# Altium project rfsoc-fr1-beamformer.PrjPcb (part 1 of 2)
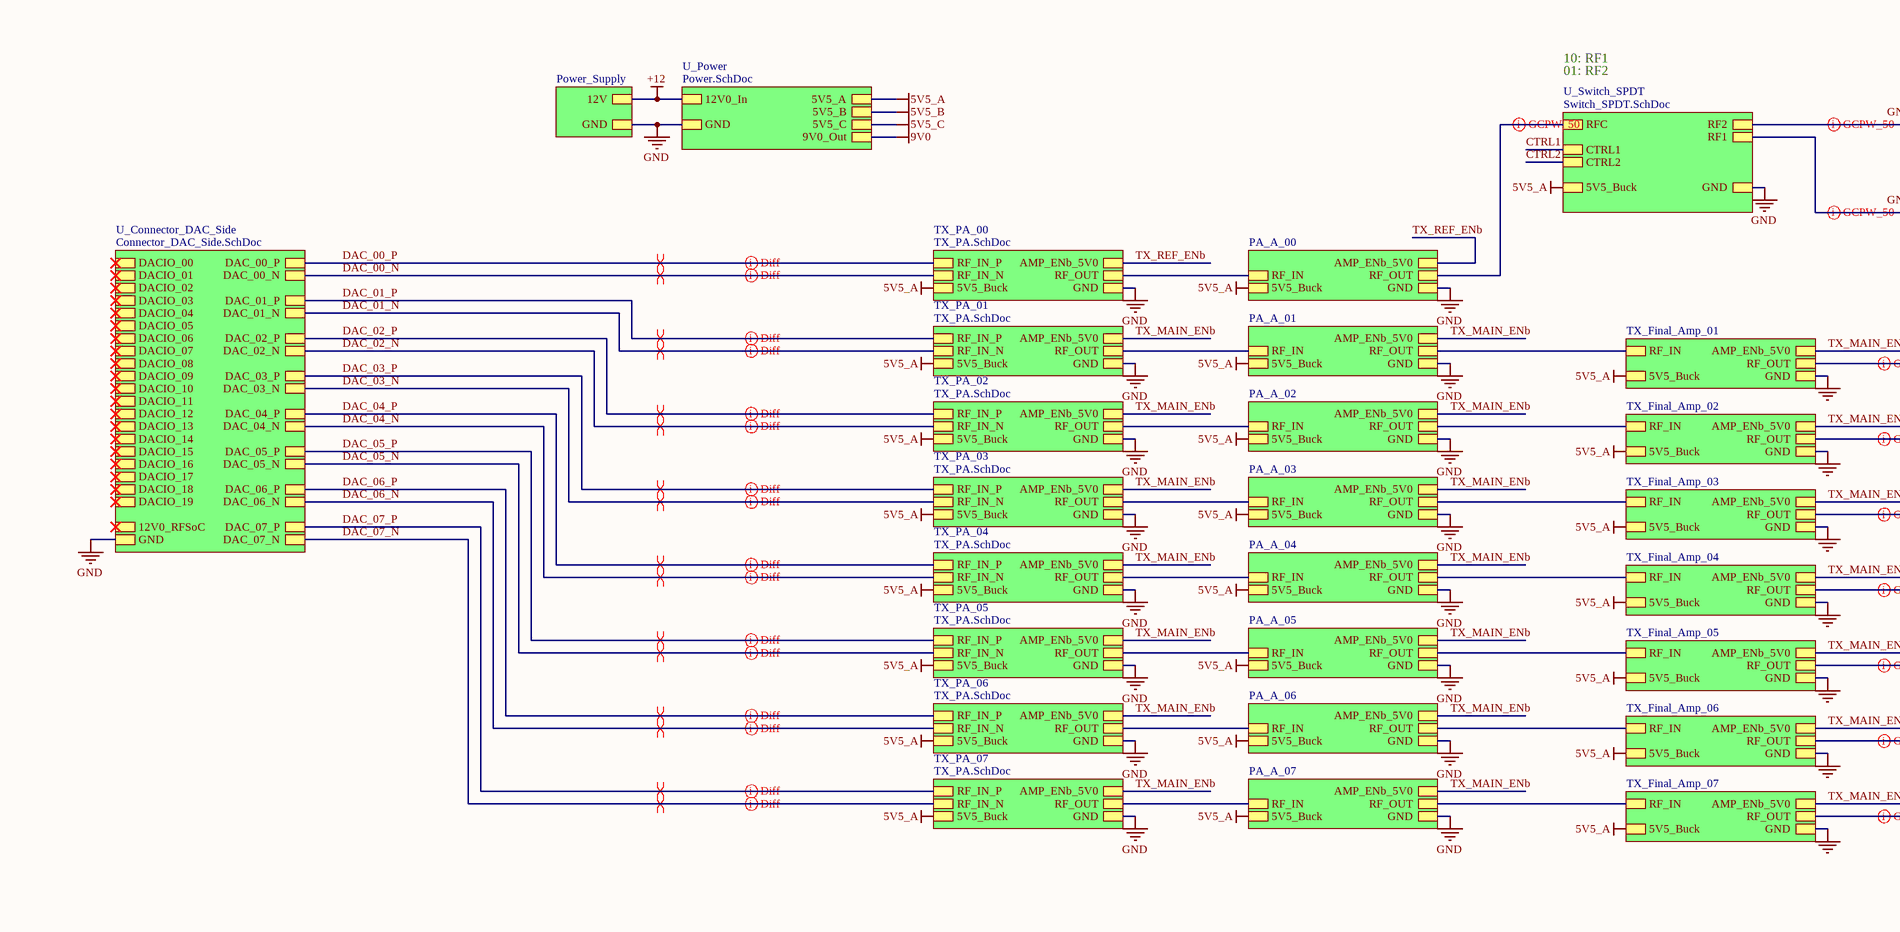
[diagram p0: Main.SchDoc, top left]
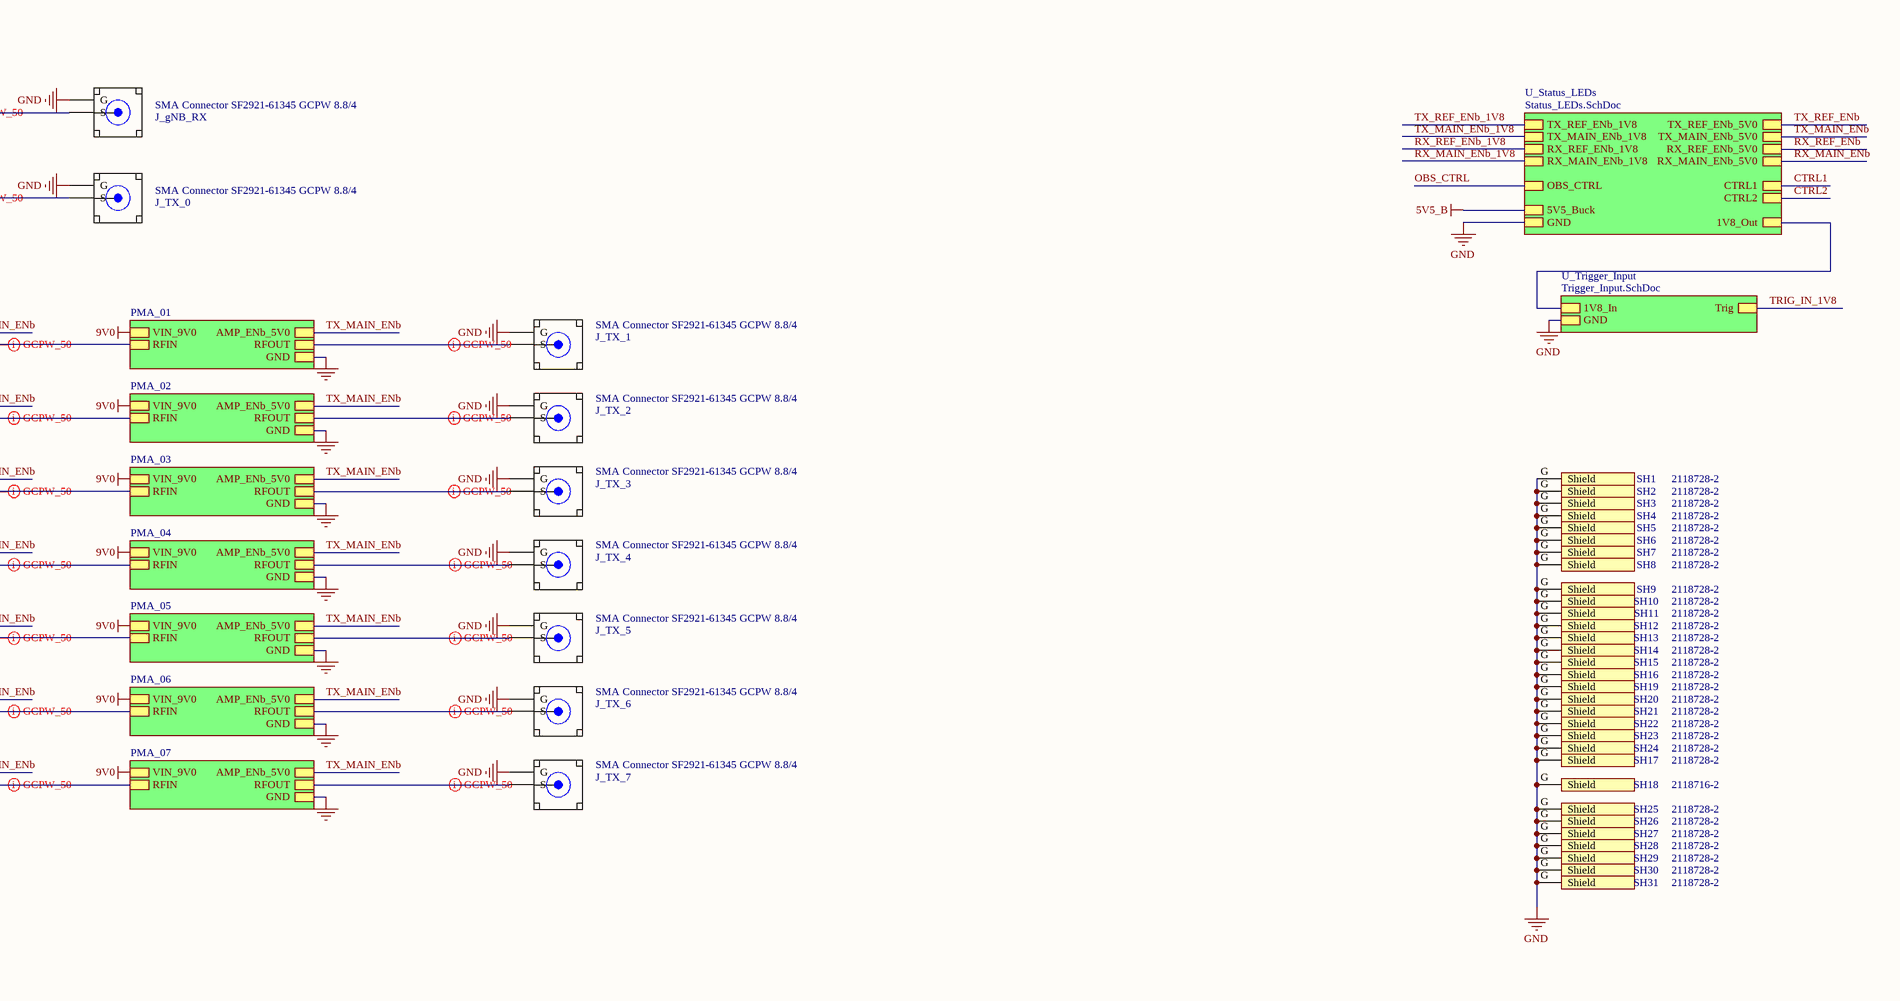
[diagram p1: Main.SchDoc, top right]
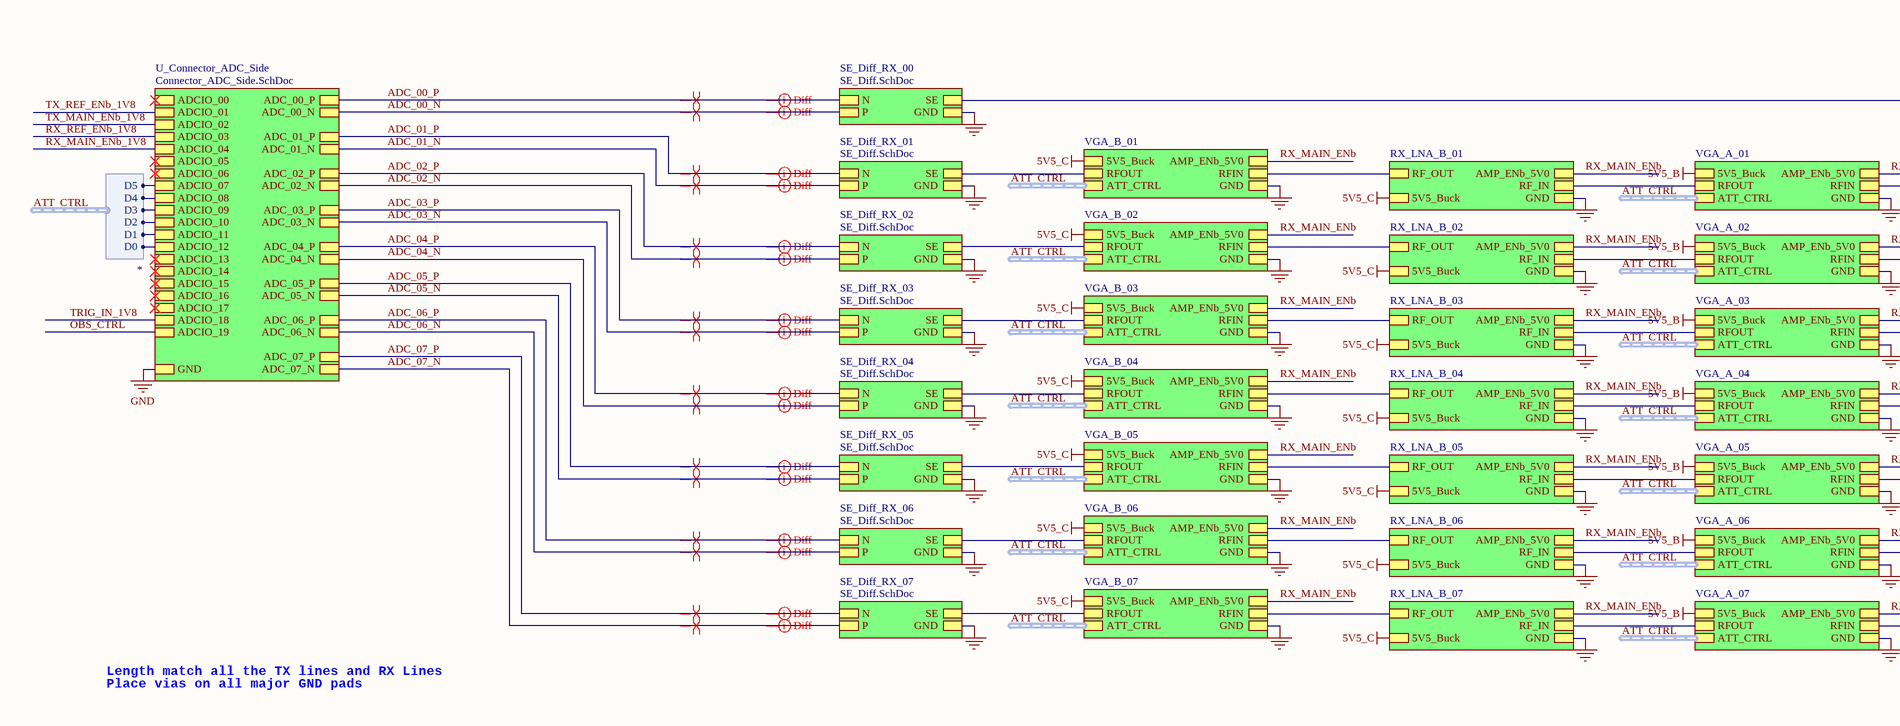
[diagram p2: Main.SchDoc, bottom left]
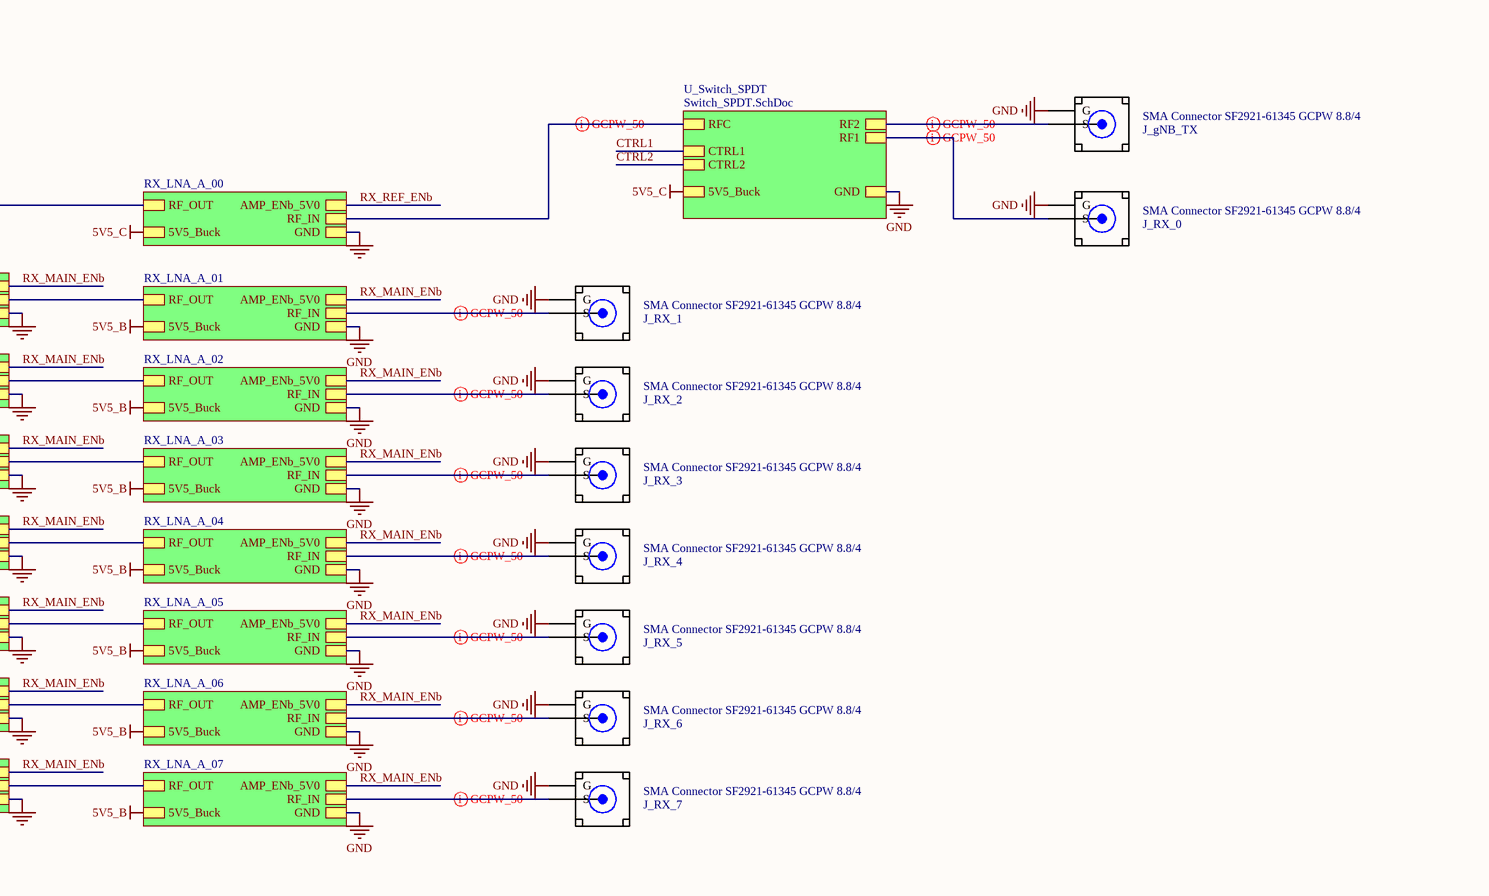
[diagram p3: Main.SchDoc, bottom right]
17 sheets, 1738 parts. Net scope: strictly hierarchical (ports join the sheet entries above them; power ports are local).
Board file: Main.PcbDoc
Sheets:
  Main.SchDoc
    U_Connector_DAC_Side = Connector_DAC_Side.SchDoc
    U_Connector_ADC_Side = Connector_ADC_Side.SchDoc
    RX_LNA_A_01 = RX_LNA.SchDoc
    RX_LNA_A_02 = RX_LNA.SchDoc
    RX_LNA_A_03 = RX_LNA.SchDoc
    RX_LNA_A_04 = RX_LNA.SchDoc
    RX_LNA_A_05 = RX_LNA.SchDoc
    RX_LNA_A_06 = RX_LNA.SchDoc
    RX_LNA_A_07 = RX_LNA.SchDoc
    RX_LNA_A_00 = RX_LNA.SchDoc
    TX_PA_00 = TX_PA.SchDoc
    TX_PA_01 = TX_PA.SchDoc
    TX_PA_02 = TX_PA.SchDoc
    TX_PA_03 = TX_PA.SchDoc
    TX_PA_04 = TX_PA.SchDoc
    TX_PA_05 = TX_PA.SchDoc
    TX_PA_06 = TX_PA.SchDoc
    TX_PA_07 = TX_PA.SchDoc
    U_Power = Power.SchDoc
      Buck_TPSM82913_5V5_A = Buck_TPSM82913_5V5.SchDoc
      Buck_TPSM82913_5V5_B = Buck_TPSM82913_5V5.SchDoc
      Buck_TPSM82913_5V5_C = Buck_TPSM82913_5V5.SchDoc
      U_Buck_TPSM843321_9V0 = Buck_TPSM843321_9V0.SchDoc
    PA_A_00 = TX_PA_Stage2.SchDoc
    PA_A_01 = TX_PA_Stage2.SchDoc
    PA_A_02 = TX_PA_Stage2.SchDoc
    PA_A_03 = TX_PA_Stage2.SchDoc
    PA_A_04 = TX_PA_Stage2.SchDoc
    PA_A_05 = TX_PA_Stage2.SchDoc
    PA_A_06 = TX_PA_Stage2.SchDoc
    PA_A_07 = TX_PA_Stage2.SchDoc
    U_Switch_SPDT = Switch_SPDT.SchDoc
    U_Switch_SPDT = Switch_SPDT.SchDoc
    U_Status_LEDs = Status_LEDs.SchDoc
    U_Trigger_Input = Trigger_Input.SchDoc
    SE_Diff_RX_00 = SE_Diff.SchDoc
    SE_Diff_RX_01 = SE_Diff.SchDoc
    SE_Diff_RX_02 = SE_Diff.SchDoc
    SE_Diff_RX_03 = SE_Diff.SchDoc
    SE_Diff_RX_04 = SE_Diff.SchDoc
    SE_Diff_RX_05 = SE_Diff.SchDoc
    SE_Diff_RX_06 = SE_Diff.SchDoc
    SE_Diff_RX_07 = SE_Diff.SchDoc
    RX_LNA_B_01 = RX_LNA.SchDoc
    RX_LNA_B_02 = RX_LNA.SchDoc
    RX_LNA_B_03 = RX_LNA.SchDoc
    RX_LNA_B_04 = RX_LNA.SchDoc
    RX_LNA_B_05 = RX_LNA.SchDoc
    RX_LNA_B_06 = RX_LNA.SchDoc
    RX_LNA_B_07 = RX_LNA.SchDoc
    VGA_A_01 = HMC625_VGA.SchDoc
    VGA_A_02 = HMC625_VGA.SchDoc
    VGA_A_03 = HMC625_VGA.SchDoc
    VGA_A_04 = HMC625_VGA.SchDoc
    VGA_A_05 = HMC625_VGA.SchDoc
    VGA_A_06 = HMC625_VGA.SchDoc
    VGA_A_07 = HMC625_VGA.SchDoc
    VGA_B_01 = HMC625_VGA.SchDoc
    VGA_B_02 = HMC625_VGA.SchDoc
    VGA_B_03 = HMC625_VGA.SchDoc
    VGA_B_04 = HMC625_VGA.SchDoc
    VGA_B_05 = HMC625_VGA.SchDoc
    VGA_B_06 = HMC625_VGA.SchDoc
    VGA_B_07 = HMC625_VGA.SchDoc
    TX_Final_Amp_01 = RX_LNA.SchDoc
    TX_Final_Amp_02 = RX_LNA.SchDoc
    TX_Final_Amp_03 = RX_LNA.SchDoc
    TX_Final_Amp_04 = RX_LNA.SchDoc
    TX_Final_Amp_05 = RX_LNA.SchDoc
    TX_Final_Amp_06 = RX_LNA.SchDoc
    TX_Final_Amp_07 = RX_LNA.SchDoc
    PMA_01 = PMA3-83MP+.SchDoc
    PMA_02 = PMA3-83MP+.SchDoc
    PMA_03 = PMA3-83MP+.SchDoc
    PMA_04 = PMA3-83MP+.SchDoc
    PMA_05 = PMA3-83MP+.SchDoc
    PMA_06 = PMA3-83MP+.SchDoc
    PMA_07 = PMA3-83MP+.SchDoc
    Power_Supply = Power_Supply.SchDoc
  RX_LNA_Preamp.SchDoc

## Sheet Main.SchDoc
size D; SheetNumber: 1; SheetTotal: 17

### Parts
J_gNB_RX  SMA Connector SF2921-61345 GCPW 8.8/4  [amphenol_sv_SF2921-61345 GCPW 8.8 by 4 mil]
J_gNB_TX  SMA Connector SF2921-61345 GCPW 8.8/4  [amphenol_sv_SF2921-61345 GCPW 8.8 by 4 mil]
J_RX_0  SMA Connector SF2921-61345 GCPW 8.8/4  [amphenol_sv_SF2921-61345 GCPW 8.8 by 4 mil]
J_RX_1  SMA Connector SF2921-61345 GCPW 8.8/4  [amphenol_sv_SF2921-61345 GCPW 8.8 by 4 mil]
J_RX_2  SMA Connector SF2921-61345 GCPW 8.8/4  [amphenol_sv_SF2921-61345 GCPW 8.8 by 4 mil]
J_RX_3  SMA Connector SF2921-61345 GCPW 8.8/4  [amphenol_sv_SF2921-61345 GCPW 8.8 by 4 mil]
J_RX_4  SMA Connector SF2921-61345 GCPW 8.8/4  [amphenol_sv_SF2921-61345 GCPW 8.8 by 4 mil]
J_RX_5  SMA Connector SF2921-61345 GCPW 8.8/4  [amphenol_sv_SF2921-61345 GCPW 8.8 by 4 mil]
J_RX_6  SMA Connector SF2921-61345 GCPW 8.8/4  [amphenol_sv_SF2921-61345 GCPW 8.8 by 4 mil]
J_RX_7  SMA Connector SF2921-61345 GCPW 8.8/4  [amphenol_sv_SF2921-61345 GCPW 8.8 by 4 mil]
J_TX_0  SMA Connector SF2921-61345 GCPW 8.8/4  [amphenol_sv_SF2921-61345 GCPW 8.8 by 4 mil]
J_TX_1  SMA Connector SF2921-61345 GCPW 8.8/4  [amphenol_sv_SF2921-61345 GCPW 8.8 by 4 mil]
J_TX_2  SMA Connector SF2921-61345 GCPW 8.8/4  [amphenol_sv_SF2921-61345 GCPW 8.8 by 4 mil]
J_TX_3  SMA Connector SF2921-61345 GCPW 8.8/4  [amphenol_sv_SF2921-61345 GCPW 8.8 by 4 mil]
J_TX_4  SMA Connector SF2921-61345 GCPW 8.8/4  [amphenol_sv_SF2921-61345 GCPW 8.8 by 4 mil]
J_TX_5  SMA Connector SF2921-61345 GCPW 8.8/4  [amphenol_sv_SF2921-61345 GCPW 8.8 by 4 mil]
J_TX_6  SMA Connector SF2921-61345 GCPW 8.8/4  [amphenol_sv_SF2921-61345 GCPW 8.8 by 4 mil]
J_TX_7  SMA Connector SF2921-61345 GCPW 8.8/4  [amphenol_sv_SF2921-61345 GCPW 8.8 by 4 mil]
SH1  2118728-2  [TE_2118728-2]
SH2  2118728-2  [TE_2118728-2]
SH3  2118728-2  [TE_2118728-2]
SH4  2118728-2  [TE_2118728-2]
SH5  2118728-2  [TE_2118728-2]
SH6  2118728-2  [TE_2118728-2]
SH7  2118728-2  [TE_2118728-2]
SH8  2118728-2  [TE_2118728-2]
SH9  2118728-2  [TE_2118728-2]
SH10  2118728-2  [TE_2118728-2]
SH11  2118728-2  [TE_2118728-2]
SH12  2118728-2  [TE_2118728-2]
SH13  2118728-2  [TE_2118728-2]
SH14  2118728-2  [TE_2118728-2]
SH15  2118728-2  [TE_2118728-2]
SH16  2118728-2  [TE_2118728-2]
SH17  2118728-2  [TE_2118728-2]
SH18  2118716-2  [TE_2118716-2]
SH19  2118728-2  [TE_2118728-2]
SH20  2118728-2  [TE_2118728-2]
SH21  2118728-2  [TE_2118728-2]
SH22  2118728-2  [TE_2118728-2]
SH23  2118728-2  [TE_2118728-2]
SH24  2118728-2  [TE_2118728-2]
SH25  2118728-2  [TE_2118728-2]
SH26  2118728-2  [TE_2118728-2]
SH27  2118728-2  [TE_2118728-2]
SH28  2118728-2  [TE_2118728-2]
SH29  2118728-2  [TE_2118728-2]
SH30  2118728-2  [TE_2118728-2]
SH31  2118728-2  [TE_2118728-2]

### Sub-sheets
PA_A_00 = TX_PA_Stage2.SchDoc: RF_IN, 5V5_Buck, GND, RF_OUT, AMP_ENb_5V0
PA_A_01 = TX_PA_Stage2.SchDoc: RF_IN, 5V5_Buck, GND, RF_OUT, AMP_ENb_5V0
PA_A_02 = TX_PA_Stage2.SchDoc: RF_IN, 5V5_Buck, GND, RF_OUT, AMP_ENb_5V0
PA_A_03 = TX_PA_Stage2.SchDoc: RF_IN, 5V5_Buck, GND, RF_OUT, AMP_ENb_5V0
PA_A_04 = TX_PA_Stage2.SchDoc: RF_IN, 5V5_Buck, GND, RF_OUT, AMP_ENb_5V0
PA_A_05 = TX_PA_Stage2.SchDoc: RF_IN, 5V5_Buck, GND, RF_OUT, AMP_ENb_5V0
PA_A_06 = TX_PA_Stage2.SchDoc: RF_IN, 5V5_Buck, GND, RF_OUT, AMP_ENb_5V0
PA_A_07 = TX_PA_Stage2.SchDoc: RF_IN, 5V5_Buck, GND, RF_OUT, AMP_ENb_5V0
PMA_01 = PMA3-83MP+.SchDoc: AMP_ENb_5V0, RFOUT, GND, VIN_9V0, RFIN
PMA_02 = PMA3-83MP+.SchDoc: AMP_ENb_5V0, RFOUT, GND, VIN_9V0, RFIN
PMA_03 = PMA3-83MP+.SchDoc: AMP_ENb_5V0, RFOUT, GND, VIN_9V0, RFIN
PMA_04 = PMA3-83MP+.SchDoc: AMP_ENb_5V0, RFOUT, GND, VIN_9V0, RFIN
PMA_05 = PMA3-83MP+.SchDoc: AMP_ENb_5V0, RFOUT, GND, VIN_9V0, RFIN
PMA_06 = PMA3-83MP+.SchDoc: AMP_ENb_5V0, RFOUT, GND, VIN_9V0, RFIN
PMA_07 = PMA3-83MP+.SchDoc: AMP_ENb_5V0, RFOUT, GND, VIN_9V0, RFIN
Power_Supply = Power_Supply.SchDoc: GND, 12V
RX_LNA_A_00 = RX_LNA.SchDoc: RF_IN, 5V5_Buck, GND, AMP_ENb_5V0, RF_OUT
RX_LNA_A_01 = RX_LNA.SchDoc: RF_IN, 5V5_Buck, GND, AMP_ENb_5V0, RF_OUT
RX_LNA_A_02 = RX_LNA.SchDoc: RF_IN, 5V5_Buck, GND, AMP_ENb_5V0, RF_OUT
RX_LNA_A_03 = RX_LNA.SchDoc: RF_IN, 5V5_Buck, GND, AMP_ENb_5V0, RF_OUT
RX_LNA_A_04 = RX_LNA.SchDoc: RF_IN, 5V5_Buck, GND, AMP_ENb_5V0, RF_OUT
RX_LNA_A_05 = RX_LNA.SchDoc: RF_IN, 5V5_Buck, GND, AMP_ENb_5V0, RF_OUT
RX_LNA_A_06 = RX_LNA.SchDoc: RF_IN, 5V5_Buck, GND, AMP_ENb_5V0, RF_OUT
RX_LNA_A_07 = RX_LNA.SchDoc: RF_IN, 5V5_Buck, GND, AMP_ENb_5V0, RF_OUT
RX_LNA_B_01 = RX_LNA.SchDoc: RF_IN, 5V5_Buck, GND, AMP_ENb_5V0, RF_OUT
RX_LNA_B_02 = RX_LNA.SchDoc: RF_IN, 5V5_Buck, GND, AMP_ENb_5V0, RF_OUT
RX_LNA_B_03 = RX_LNA.SchDoc: RF_IN, 5V5_Buck, GND, AMP_ENb_5V0, RF_OUT
RX_LNA_B_04 = RX_LNA.SchDoc: RF_IN, 5V5_Buck, GND, AMP_ENb_5V0, RF_OUT
RX_LNA_B_05 = RX_LNA.SchDoc: RF_IN, 5V5_Buck, GND, AMP_ENb_5V0, RF_OUT
RX_LNA_B_06 = RX_LNA.SchDoc: RF_IN, 5V5_Buck, GND, AMP_ENb_5V0, RF_OUT
RX_LNA_B_07 = RX_LNA.SchDoc: RF_IN, 5V5_Buck, GND, AMP_ENb_5V0, RF_OUT
SE_Diff_RX_00 = SE_Diff.SchDoc: SE, GND, N, P
SE_Diff_RX_01 = SE_Diff.SchDoc: SE, GND, N, P
SE_Diff_RX_02 = SE_Diff.SchDoc: SE, GND, N, P
SE_Diff_RX_03 = SE_Diff.SchDoc: SE, GND, N, P
SE_Diff_RX_04 = SE_Diff.SchDoc: SE, GND, N, P
SE_Diff_RX_05 = SE_Diff.SchDoc: SE, GND, N, P
SE_Diff_RX_06 = SE_Diff.SchDoc: SE, GND, N, P
SE_Diff_RX_07 = SE_Diff.SchDoc: SE, GND, N, P
TX_Final_Amp_01 = RX_LNA.SchDoc: RF_IN, GND, 5V5_Buck, AMP_ENb_5V0, RF_OUT
TX_Final_Amp_02 = RX_LNA.SchDoc: RF_IN, GND, 5V5_Buck, AMP_ENb_5V0, RF_OUT
TX_Final_Amp_03 = RX_LNA.SchDoc: RF_IN, GND, 5V5_Buck, AMP_ENb_5V0, RF_OUT
TX_Final_Amp_04 = RX_LNA.SchDoc: RF_IN, GND, 5V5_Buck, AMP_ENb_5V0, RF_OUT
TX_Final_Amp_05 = RX_LNA.SchDoc: RF_IN, GND, 5V5_Buck, AMP_ENb_5V0, RF_OUT
TX_Final_Amp_06 = RX_LNA.SchDoc: RF_IN, GND, 5V5_Buck, AMP_ENb_5V0, RF_OUT
TX_Final_Amp_07 = RX_LNA.SchDoc: RF_IN, GND, 5V5_Buck, AMP_ENb_5V0, RF_OUT
TX_PA_00 = TX_PA.SchDoc: RF_OUT, GND, 5V5_Buck, RF_IN_P, RF_IN_N, AMP_ENb_5V0
TX_PA_01 = TX_PA.SchDoc: RF_OUT, GND, 5V5_Buck, RF_IN_P, RF_IN_N, AMP_ENb_5V0
TX_PA_02 = TX_PA.SchDoc: RF_OUT, GND, 5V5_Buck, RF_IN_P, RF_IN_N, AMP_ENb_5V0
TX_PA_03 = TX_PA.SchDoc: RF_OUT, GND, 5V5_Buck, RF_IN_P, RF_IN_N, AMP_ENb_5V0
TX_PA_04 = TX_PA.SchDoc: RF_OUT, GND, 5V5_Buck, RF_IN_P, RF_IN_N, AMP_ENb_5V0
TX_PA_05 = TX_PA.SchDoc: RF_OUT, GND, 5V5_Buck, RF_IN_P, RF_IN_N, AMP_ENb_5V0
TX_PA_06 = TX_PA.SchDoc: RF_OUT, GND, 5V5_Buck, RF_IN_P, RF_IN_N, AMP_ENb_5V0
TX_PA_07 = TX_PA.SchDoc: RF_OUT, GND, 5V5_Buck, RF_IN_P, RF_IN_N, AMP_ENb_5V0
U_Connector_ADC_Side = Connector_ADC_Side.SchDoc: ADCIO_00, ADCIO_01, ADCIO_02, ADCIO_03, ADCIO_04, ADCIO_05, ADCIO_06, ADCIO_07, ADCIO_08, ADCIO_09, ADCIO_10, ADCIO_11, ADCIO_12, ADCIO_13, ADCIO_14, ADCIO_15, ADCIO_16, ADCIO_17, ADCIO_18, ADCIO_19, ADC_00_P, ADC_00_N, ADC_01_P, ADC_01_N, ADC_02_P, ADC_02_N, ADC_03_P, ADC_03_N, ADC_04_P, ADC_04_N, ADC_05_P, ADC_05_N, ADC_06_P, ADC_06_N, ADC_07_P, ADC_07_N, GND
U_Connector_DAC_Side = Connector_DAC_Side.SchDoc: DACIO_00, DACIO_01, DACIO_02, DACIO_03, DACIO_04, DACIO_05, DACIO_06, DACIO_07, DACIO_08, DACIO_09, DACIO_10, DACIO_11, DACIO_12, DACIO_13, DACIO_14, DACIO_15, DACIO_16, DACIO_17, DACIO_18, DACIO_19, DAC_00_P, DAC_00_N, DAC_01_P, DAC_01_N, DAC_02_P, DAC_02_N, DAC_03_P, DAC_03_N, DAC_04_P, DAC_04_N, DAC_05_P, DAC_05_N, DAC_06_P, DAC_06_N, DAC_07_P, DAC_07_N, GND, 12V0_RFSoC
U_Power = Power.SchDoc: 12V0_In, GND, 5V5_A, 5V5_B, 5V5_C, 9V0_Out
U_Status_LEDs = Status_LEDs.SchDoc: 5V5_Buck, GND, OBS_CTRL, CTRL1, CTRL2, 1V8_Out, TX_REF_ENb_1V8, TX_MAIN_ENb_1V8, RX_REF_ENb_1V8, RX_MAIN_ENb_1V8, TX_REF_ENb_5V0, TX_MAIN_ENb_5V0, RX_REF_ENb_5V0, RX_MAIN_ENb_5V0
U_Switch_SPDT = Switch_SPDT.SchDoc: RFC, CTRL1, CTRL2, 5V5_Buck, GND, RF2, RF1
U_Switch_SPDT = Switch_SPDT.SchDoc: RFC, CTRL1, CTRL2, 5V5_Buck, GND, RF2, RF1
U_Trigger_Input = Trigger_Input.SchDoc: 1V8_In, Trig, GND
VGA_A_01 = HMC625_VGA.SchDoc: AMP_ENb_5V0, 5V5_Buck, RFIN, RFOUT, GND, ATT_CTRL (harness *)
VGA_A_02 = HMC625_VGA.SchDoc: AMP_ENb_5V0, 5V5_Buck, RFIN, RFOUT, GND, ATT_CTRL (harness *)
VGA_A_03 = HMC625_VGA.SchDoc: AMP_ENb_5V0, 5V5_Buck, RFIN, RFOUT, GND, ATT_CTRL (harness *)
VGA_A_04 = HMC625_VGA.SchDoc: AMP_ENb_5V0, 5V5_Buck, RFIN, RFOUT, GND, ATT_CTRL (harness *)
VGA_A_05 = HMC625_VGA.SchDoc: AMP_ENb_5V0, 5V5_Buck, RFIN, RFOUT, GND, ATT_CTRL (harness *)
VGA_A_06 = HMC625_VGA.SchDoc: AMP_ENb_5V0, 5V5_Buck, RFIN, RFOUT, GND, ATT_CTRL (harness *)
VGA_A_07 = HMC625_VGA.SchDoc: AMP_ENb_5V0, 5V5_Buck, RFIN, RFOUT, GND, ATT_CTRL (harness *)
VGA_B_01 = HMC625_VGA.SchDoc: AMP_ENb_5V0, 5V5_Buck, RFIN, RFOUT, GND, ATT_CTRL (harness *)
VGA_B_02 = HMC625_VGA.SchDoc: AMP_ENb_5V0, 5V5_Buck, RFIN, RFOUT, GND, ATT_CTRL (harness *)
VGA_B_03 = HMC625_VGA.SchDoc: AMP_ENb_5V0, 5V5_Buck, RFIN, RFOUT, GND, ATT_CTRL (harness *)
VGA_B_04 = HMC625_VGA.SchDoc: AMP_ENb_5V0, 5V5_Buck, RFIN, RFOUT, GND, ATT_CTRL (harness *)
VGA_B_05 = HMC625_VGA.SchDoc: AMP_ENb_5V0, 5V5_Buck, RFIN, RFOUT, GND, ATT_CTRL (harness *)
VGA_B_06 = HMC625_VGA.SchDoc: AMP_ENb_5V0, 5V5_Buck, RFIN, RFOUT, GND, ATT_CTRL (harness *)
VGA_B_07 = HMC625_VGA.SchDoc: AMP_ENb_5V0, 5V5_Buck, RFIN, RFOUT, GND, ATT_CTRL (harness *)

### Harnesses
*: D0, D1, D2, D3, D4, D5

### Nets
5V5_A: sheet TX_PA_00/5V5_Buck, sheet TX_PA_01/5V5_Buck, sheet TX_PA_02/5V5_Buck, sheet TX_PA_03/5V5_Buck, sheet TX_PA_04/5V5_Buck, sheet TX_PA_05/5V5_Buck, sheet TX_PA_06/5V5_Buck, sheet TX_PA_07/5V5_Buck, sheet U_Power/5V5_A, sheet PA_A_00/5V5_Buck, sheet PA_A_01/5V5_Buck, sheet PA_A_02/5V5_Buck, sheet PA_A_03/5V5_Buck, sheet PA_A_04/5V5_Buck, sheet PA_A_05/5V5_Buck, sheet PA_A_06/5V5_Buck, sheet PA_A_07/5V5_Buck, sheet U_Switch_SPDT/5V5_Buck, sheet TX_Final_Amp_01/5V5_Buck, sheet TX_Final_Amp_02/5V5_Buck, sheet TX_Final_Amp_03/5V5_Buck, sheet TX_Final_Amp_04/5V5_Buck, sheet TX_Final_Amp_05/5V5_Buck, sheet TX_Final_Amp_06/5V5_Buck, sheet TX_Final_Amp_07/5V5_Buck
5V5_B: sheet RX_LNA_A_01/5V5_Buck, sheet RX_LNA_A_02/5V5_Buck, sheet RX_LNA_A_03/5V5_Buck, sheet RX_LNA_A_04/5V5_Buck, sheet RX_LNA_A_05/5V5_Buck, sheet RX_LNA_A_06/5V5_Buck, sheet RX_LNA_A_07/5V5_Buck, sheet U_Power/5V5_B, sheet U_Status_LEDs/5V5_Buck, sheet VGA_A_01/5V5_Buck, sheet VGA_A_02/5V5_Buck, sheet VGA_A_03/5V5_Buck, sheet VGA_A_04/5V5_Buck, sheet VGA_A_05/5V5_Buck, sheet VGA_A_06/5V5_Buck, sheet VGA_A_07/5V5_Buck
5V5_C: sheet RX_LNA_A_00/5V5_Buck, sheet U_Power/5V5_C, sheet U_Switch_SPDT/5V5_Buck, sheet RX_LNA_B_01/5V5_Buck, sheet RX_LNA_B_02/5V5_Buck, sheet RX_LNA_B_03/5V5_Buck, sheet RX_LNA_B_04/5V5_Buck, sheet RX_LNA_B_05/5V5_Buck, sheet RX_LNA_B_06/5V5_Buck, sheet RX_LNA_B_07/5V5_Buck, sheet VGA_B_01/5V5_Buck, sheet VGA_B_02/5V5_Buck, sheet VGA_B_03/5V5_Buck, sheet VGA_B_04/5V5_Buck, sheet VGA_B_05/5V5_Buck, sheet VGA_B_06/5V5_Buck, sheet VGA_B_07/5V5_Buck
9V0: sheet U_Power/9V0_Out, sheet PMA_01/VIN_9V0, sheet PMA_02/VIN_9V0, sheet PMA_03/VIN_9V0, sheet PMA_04/VIN_9V0, sheet PMA_05/VIN_9V0, sheet PMA_06/VIN_9V0, sheet PMA_07/VIN_9V0
+12: sheet U_Power/12V0_In, sheet Power_Supply/12V
GND: J_gNB_RX.G J_gNB_TX.G J_RX_0.G J_RX_1.G J_RX_2.G J_RX_3.G J_RX_4.G J_RX_5.G J_RX_6.G J_RX_7.G J_TX_0.G J_TX_1.G J_TX_2.G J_TX_3.G J_TX_4.G J_TX_5.G J_TX_6.G J_TX_7.G SH1.G(Shield) SH2.G(Shield) SH3.G(Shield) SH4.G(Shield) SH5.G(Shield) SH6.G(Shield) SH7.G(Shield) SH8.G(Shield) SH9.G(Shield) SH10.G(Shield) SH11.G(Shield) SH12.G(Shield) SH13.G(Shield) SH14.G(Shield) SH15.G(Shield) SH16.G(Shield) SH17.G(Shield) SH18.G(Shield) SH19.G(Shield) SH20.G(Shield) SH21.G(Shield) SH22.G(Shield) SH23.G(Shield) SH24.G(Shield) SH25.G(Shield) SH26.G(Shield) SH27.G(Shield) SH28.G(Shield) SH29.G(Shield) SH30.G(Shield) SH31.G(Shield) ; sheet U_Connector_DAC_Side/GND, sheet U_Connector_ADC_Side/GND, sheet RX_LNA_A_01/GND, sheet RX_LNA_A_02/GND, sheet RX_LNA_A_03/GND, sheet RX_LNA_A_04/GND, sheet RX_LNA_A_05/GND, sheet RX_LNA_A_06/GND, sheet RX_LNA_A_07/GND, sheet RX_LNA_A_00/GND, sheet TX_PA_00/GND, sheet TX_PA_01/GND, sheet TX_PA_02/GND, sheet TX_PA_03/GND, sheet TX_PA_04/GND, sheet TX_PA_05/GND, sheet TX_PA_06/GND, sheet TX_PA_07/GND, sheet U_Power/GND, sheet PA_A_00/GND, sheet PA_A_01/GND, sheet PA_A_02/GND, sheet PA_A_03/GND, sheet PA_A_04/GND, sheet PA_A_05/GND, sheet PA_A_06/GND, sheet PA_A_07/GND, sheet U_Switch_SPDT/GND, sheet U_Switch_SPDT/GND, sheet U_Status_LEDs/GND, sheet U_Trigger_Input/GND, sheet SE_Diff_RX_00/GND, sheet SE_Diff_RX_01/GND, sheet SE_Diff_RX_02/GND, sheet SE_Diff_RX_03/GND, sheet SE_Diff_RX_04/GND, sheet SE_Diff_RX_05/GND, sheet SE_Diff_RX_06/GND, sheet SE_Diff_RX_07/GND, sheet RX_LNA_B_01/GND, sheet RX_LNA_B_02/GND, sheet RX_LNA_B_03/GND, sheet RX_LNA_B_04/GND, sheet RX_LNA_B_05/GND, sheet RX_LNA_B_06/GND, sheet RX_LNA_B_07/GND, sheet VGA_A_01/GND, sheet VGA_A_02/GND, sheet VGA_A_03/GND, sheet VGA_A_04/GND, sheet VGA_A_05/GND, sheet VGA_A_06/GND, sheet VGA_A_07/GND, sheet VGA_B_01/GND, sheet VGA_B_02/GND, sheet VGA_B_03/GND, sheet VGA_B_04/GND, sheet VGA_B_05/GND, sheet VGA_B_06/GND, sheet VGA_B_07/GND, sheet TX_Final_Amp_01/GND, sheet TX_Final_Amp_02/GND, sheet TX_Final_Amp_03/GND, sheet TX_Final_Amp_04/GND, sheet TX_Final_Amp_05/GND, sheet TX_Final_Amp_06/GND, sheet TX_Final_Amp_07/GND, sheet PMA_01/GND, sheet PMA_02/GND, sheet PMA_03/GND, sheet PMA_04/GND, sheet PMA_05/GND, sheet PMA_06/GND, sheet PMA_07/GND, sheet Power_Supply/GND
1V8_LDO: sheet U_Status_LEDs/1V8_Out, sheet U_Trigger_Input/1V8_In
ADC_00_N: sheet U_Connector_ADC_Side/ADC_00_N, sheet SE_Diff_RX_00/P
ADC_00_P: sheet U_Connector_ADC_Side/ADC_00_P, sheet SE_Diff_RX_00/N
ADC_01_N: sheet U_Connector_ADC_Side/ADC_01_N, sheet SE_Diff_RX_01/P
ADC_01_P: sheet U_Connector_ADC_Side/ADC_01_P, sheet SE_Diff_RX_01/N
ADC_02_N: sheet U_Connector_ADC_Side/ADC_02_N, sheet SE_Diff_RX_02/P
ADC_02_P: sheet U_Connector_ADC_Side/ADC_02_P, sheet SE_Diff_RX_02/N
ADC_03_N: sheet U_Connector_ADC_Side/ADC_03_N, sheet SE_Diff_RX_03/P
ADC_03_P: sheet U_Connector_ADC_Side/ADC_03_P, sheet SE_Diff_RX_03/N
ADC_04_N: sheet U_Connector_ADC_Side/ADC_04_N, sheet SE_Diff_RX_04/P
ADC_04_P: sheet U_Connector_ADC_Side/ADC_04_P, sheet SE_Diff_RX_04/N
ADC_05_N: sheet U_Connector_ADC_Side/ADC_05_N, sheet SE_Diff_RX_05/P
ADC_05_P: sheet U_Connector_ADC_Side/ADC_05_P, sheet SE_Diff_RX_05/N
ADC_06_N: sheet U_Connector_ADC_Side/ADC_06_N, sheet SE_Diff_RX_06/P
ADC_06_P: sheet U_Connector_ADC_Side/ADC_06_P, sheet SE_Diff_RX_06/N
ADC_07_N: sheet U_Connector_ADC_Side/ADC_07_N, sheet SE_Diff_RX_07/P
ADC_07_P: sheet U_Connector_ADC_Side/ADC_07_P, sheet SE_Diff_RX_07/N
ATT_CTRL.D0: sheet U_Connector_ADC_Side/ADCIO_12, sheet VGA_A_01/ATT_CTRL.D0
ATT_CTRL.D1: sheet U_Connector_ADC_Side/ADCIO_11, sheet VGA_A_01/ATT_CTRL.D1
ATT_CTRL.D2: sheet U_Connector_ADC_Side/ADCIO_10, sheet VGA_A_01/ATT_CTRL.D2
ATT_CTRL.D3: sheet U_Connector_ADC_Side/ADCIO_09, sheet VGA_A_01/ATT_CTRL.D3
ATT_CTRL.D4: sheet U_Connector_ADC_Side/ADCIO_08, sheet VGA_A_01/ATT_CTRL.D4
ATT_CTRL.D5: sheet U_Connector_ADC_Side/ADCIO_07, sheet VGA_A_01/ATT_CTRL.D5
CTRL1: sheet U_Switch_SPDT/CTRL1, sheet U_Switch_SPDT/CTRL1, sheet U_Status_LEDs/CTRL1
CTRL2: sheet U_Connector_ADC_Side/ADCIO_19, sheet U_Switch_SPDT/CTRL2, sheet U_Switch_SPDT/CTRL2, sheet U_Status_LEDs/OBS_CTRL, sheet U_Status_LEDs/CTRL2  [also labelled OBS_CTRL]
DAC_00_N: sheet U_Connector_DAC_Side/DAC_00_N, sheet TX_PA_00/RF_IN_N
DAC_00_P: sheet U_Connector_DAC_Side/DAC_00_P, sheet TX_PA_00/RF_IN_P
DAC_01_N: sheet U_Connector_DAC_Side/DAC_01_N, sheet TX_PA_01/RF_IN_N
DAC_01_P: sheet U_Connector_DAC_Side/DAC_01_P, sheet TX_PA_01/RF_IN_P
DAC_02_N: sheet U_Connector_DAC_Side/DAC_02_N, sheet TX_PA_02/RF_IN_N
DAC_02_P: sheet U_Connector_DAC_Side/DAC_02_P, sheet TX_PA_02/RF_IN_P
DAC_03_N: sheet U_Connector_DAC_Side/DAC_03_N, sheet TX_PA_03/RF_IN_N
DAC_03_P: sheet U_Connector_DAC_Side/DAC_03_P, sheet TX_PA_03/RF_IN_P
DAC_04_N: sheet U_Connector_DAC_Side/DAC_04_N, sheet TX_PA_04/RF_IN_N
DAC_04_P: sheet U_Connector_DAC_Side/DAC_04_P, sheet TX_PA_04/RF_IN_P
DAC_05_N: sheet U_Connector_DAC_Side/DAC_05_N, sheet TX_PA_05/RF_IN_N
DAC_05_P: sheet U_Connector_DAC_Side/DAC_05_P, sheet TX_PA_05/RF_IN_P
DAC_06_N: sheet U_Connector_DAC_Side/DAC_06_N, sheet TX_PA_06/RF_IN_N
DAC_06_P: sheet U_Connector_DAC_Side/DAC_06_P, sheet TX_PA_06/RF_IN_P
DAC_07_N: sheet U_Connector_DAC_Side/DAC_07_N, sheet TX_PA_07/RF_IN_N
DAC_07_P: sheet U_Connector_DAC_Side/DAC_07_P, sheet TX_PA_07/RF_IN_P
RX_MAIN_ENb: sheet RX_LNA_A_01/AMP_ENb_5V0, sheet RX_LNA_A_02/AMP_ENb_5V0, sheet RX_LNA_A_03/AMP_ENb_5V0, sheet RX_LNA_A_04/AMP_ENb_5V0, sheet RX_LNA_A_05/AMP_ENb_5V0, sheet RX_LNA_A_06/AMP_ENb_5V0, sheet RX_LNA_A_07/AMP_ENb_5V0, sheet U_Status_LEDs/RX_MAIN_ENb_5V0, sheet RX_LNA_B_01/AMP_ENb_5V0, sheet RX_LNA_B_02/AMP_ENb_5V0, sheet RX_LNA_B_03/AMP_ENb_5V0, sheet RX_LNA_B_04/AMP_ENb_5V0, sheet RX_LNA_B_05/AMP_ENb_5V0, sheet RX_LNA_B_06/AMP_ENb_5V0, sheet RX_LNA_B_07/AMP_ENb_5V0, sheet VGA_A_01/AMP_ENb_5V0, sheet VGA_A_02/AMP_ENb_5V0, sheet VGA_A_03/AMP_ENb_5V0, sheet VGA_A_04/AMP_ENb_5V0, sheet VGA_A_05/AMP_ENb_5V0, sheet VGA_A_06/AMP_ENb_5V0, sheet VGA_A_07/AMP_ENb_5V0, sheet VGA_B_01/AMP_ENb_5V0, sheet VGA_B_02/AMP_ENb_5V0, sheet VGA_B_03/AMP_ENb_5V0, sheet VGA_B_04/AMP_ENb_5V0, sheet VGA_B_05/AMP_ENb_5V0, sheet VGA_B_06/AMP_ENb_5V0, sheet VGA_B_07/AMP_ENb_5V0
RX_MAIN_ENb_1V8: sheet U_Connector_ADC_Side/ADCIO_04, sheet U_Status_LEDs/RX_MAIN_ENb_1V8
RX_REF_ENb: sheet RX_LNA_A_00/AMP_ENb_5V0, sheet U_Status_LEDs/RX_REF_ENb_5V0
RX_REF_ENb_1V8: sheet U_Connector_ADC_Side/ADCIO_03, sheet U_Status_LEDs/RX_REF_ENb_1V8
TRIG_IN_1V8: sheet U_Connector_ADC_Side/ADCIO_18, sheet U_Trigger_Input/Trig
TX_MAIN_ENb: sheet TX_PA_01/AMP_ENb_5V0, sheet TX_PA_02/AMP_ENb_5V0, sheet TX_PA_03/AMP_ENb_5V0, sheet TX_PA_04/AMP_ENb_5V0, sheet TX_PA_05/AMP_ENb_5V0, sheet TX_PA_06/AMP_ENb_5V0, sheet TX_PA_07/AMP_ENb_5V0, sheet PA_A_01/AMP_ENb_5V0, sheet PA_A_02/AMP_ENb_5V0, sheet PA_A_03/AMP_ENb_5V0, sheet PA_A_04/AMP_ENb_5V0, sheet PA_A_05/AMP_ENb_5V0, sheet PA_A_06/AMP_ENb_5V0, sheet PA_A_07/AMP_ENb_5V0, sheet U_Status_LEDs/TX_MAIN_ENb_5V0, sheet TX_Final_Amp_01/AMP_ENb_5V0, sheet TX_Final_Amp_02/AMP_ENb_5V0, sheet TX_Final_Amp_03/AMP_ENb_5V0, sheet TX_Final_Amp_04/AMP_ENb_5V0, sheet TX_Final_Amp_05/AMP_ENb_5V0, sheet TX_Final_Amp_06/AMP_ENb_5V0, sheet TX_Final_Amp_07/AMP_ENb_5V0, sheet PMA_01/AMP_ENb_5V0, sheet PMA_02/AMP_ENb_5V0, sheet PMA_03/AMP_ENb_5V0, sheet PMA_04/AMP_ENb_5V0, sheet PMA_05/AMP_ENb_5V0, sheet PMA_06/AMP_ENb_5V0, sheet PMA_07/AMP_ENb_5V0
TX_MAIN_ENb_1V8: sheet U_Connector_ADC_Side/ADCIO_02, sheet U_Status_LEDs/TX_MAIN_ENb_1V8
TX_REF_ENb: sheet TX_PA_00/AMP_ENb_5V0, sheet PA_A_00/AMP_ENb_5V0, sheet U_Status_LEDs/TX_REF_ENb_5V0
TX_REF_ENb_1V8: sheet U_Connector_ADC_Side/ADCIO_01, sheet U_Status_LEDs/TX_REF_ENb_1V8
NetC5_1_2: sheet TX_PA_00/RF_OUT, sheet PA_A_00/RF_IN
NetC5_2_2: sheet TX_PA_01/RF_OUT, sheet PA_A_01/RF_IN
NetC5_3_2: sheet TX_PA_02/RF_OUT, sheet PA_A_02/RF_IN
NetC5_4_2: sheet TX_PA_03/RF_OUT, sheet PA_A_03/RF_IN
NetC5_5_2: sheet TX_PA_04/RF_OUT, sheet PA_A_04/RF_IN
NetC5_6_2: sheet TX_PA_05/RF_OUT, sheet PA_A_05/RF_IN
NetC5_7_2: sheet TX_PA_06/RF_OUT, sheet PA_A_06/RF_IN
NetC5_8_2: sheet TX_PA_07/RF_OUT, sheet PA_A_07/RF_IN
NetC21_1_2: J_RX_1.S ; sheet RX_LNA_A_01/RF_IN
NetC21_2_2: J_RX_2.S ; sheet RX_LNA_A_02/RF_IN
NetC21_3_2: J_RX_3.S ; sheet RX_LNA_A_03/RF_IN
NetC21_4_2: J_RX_4.S ; sheet RX_LNA_A_04/RF_IN
NetC21_5_2: J_RX_5.S ; sheet RX_LNA_A_05/RF_IN
NetC21_6_2: J_RX_6.S ; sheet RX_LNA_A_06/RF_IN
NetC21_7_2: J_RX_7.S ; sheet RX_LNA_A_07/RF_IN
NetC21_8_2: sheet RX_LNA_A_00/RF_IN, sheet U_Switch_SPDT/RFC
NetC21_9_2: sheet RX_LNA_B_01/RF_IN, sheet VGA_A_01/RFOUT
NetC21_10_2: sheet RX_LNA_B_02/RF_IN, sheet VGA_A_02/RFOUT
NetC21_11_2: sheet RX_LNA_B_03/RF_IN, sheet VGA_A_03/RFOUT
NetC21_12_2: sheet RX_LNA_B_04/RF_IN, sheet VGA_A_04/RFOUT
NetC21_13_2: sheet RX_LNA_B_05/RF_IN, sheet VGA_A_05/RFOUT
NetC21_14_2: sheet RX_LNA_B_06/RF_IN, sheet VGA_A_06/RFOUT
NetC21_15_2: sheet RX_LNA_B_07/RF_IN, sheet VGA_A_07/RFOUT
NetC21_16_2: sheet PA_A_01/RF_OUT, sheet TX_Final_Amp_01/RF_IN
NetC21_17_2: sheet PA_A_02/RF_OUT, sheet TX_Final_Amp_02/RF_IN
NetC21_18_2: sheet PA_A_03/RF_OUT, sheet TX_Final_Amp_03/RF_IN
NetC21_19_2: sheet PA_A_04/RF_OUT, sheet TX_Final_Amp_04/RF_IN
NetC21_20_2: sheet PA_A_05/RF_OUT, sheet TX_Final_Amp_05/RF_IN
NetC21_21_2: sheet PA_A_06/RF_OUT, sheet TX_Final_Amp_06/RF_IN
NetC21_22_2: sheet PA_A_07/RF_OUT, sheet TX_Final_Amp_07/RF_IN
NetC23_1_1: sheet RX_LNA_A_01/RF_OUT, sheet VGA_A_01/RFIN
NetC23_2_1: sheet RX_LNA_A_02/RF_OUT, sheet VGA_A_02/RFIN
NetC23_3_1: sheet RX_LNA_A_03/RF_OUT, sheet VGA_A_03/RFIN
NetC23_4_1: sheet RX_LNA_A_04/RF_OUT, sheet VGA_A_04/RFIN
NetC23_5_1: sheet RX_LNA_A_05/RF_OUT, sheet VGA_A_05/RFIN
NetC23_6_1: sheet RX_LNA_A_06/RF_OUT, sheet VGA_A_06/RFIN
NetC23_7_1: sheet RX_LNA_A_07/RF_OUT, sheet VGA_A_07/RFIN
NetC23_8_1: sheet RX_LNA_A_00/RF_OUT, sheet SE_Diff_RX_00/SE
NetC23_9_1: sheet RX_LNA_B_01/RF_OUT, sheet VGA_B_01/RFIN
NetC23_10_1: sheet RX_LNA_B_02/RF_OUT, sheet VGA_B_02/RFIN
NetC23_11_1: sheet RX_LNA_B_03/RF_OUT, sheet VGA_B_03/RFIN
NetC23_12_1: sheet RX_LNA_B_04/RF_OUT, sheet VGA_B_04/RFIN
NetC23_13_1: sheet RX_LNA_B_05/RF_OUT, sheet VGA_B_05/RFIN
NetC23_14_1: sheet RX_LNA_B_06/RF_OUT, sheet VGA_B_06/RFIN
NetC23_15_1: sheet RX_LNA_B_07/RF_OUT, sheet VGA_B_07/RFIN
NetC23_16_1: sheet TX_Final_Amp_01/RF_OUT, sheet PMA_01/RFIN
NetC23_17_1: sheet TX_Final_Amp_02/RF_OUT, sheet PMA_02/RFIN
NetC23_18_1: sheet TX_Final_Amp_03/RF_OUT, sheet PMA_03/RFIN
NetC23_19_1: sheet TX_Final_Amp_04/RF_OUT, sheet PMA_04/RFIN
NetC23_20_1: sheet TX_Final_Amp_05/RF_OUT, sheet PMA_05/RFIN
NetC23_21_1: sheet TX_Final_Amp_06/RF_OUT, sheet PMA_06/RFIN
NetC23_22_1: sheet TX_Final_Amp_07/RF_OUT, sheet PMA_07/RFIN
NetC44_8_1: sheet SE_Diff_RX_01/SE, sheet VGA_B_01/RFOUT
NetC44_9_1: sheet SE_Diff_RX_02/SE, sheet VGA_B_02/RFOUT
NetC44_10_1: sheet SE_Diff_RX_03/SE, sheet VGA_B_03/RFOUT
NetC44_11_1: sheet SE_Diff_RX_04/SE, sheet VGA_B_04/RFOUT
NetC44_12_1: sheet SE_Diff_RX_05/SE, sheet VGA_B_05/RFOUT
NetC44_13_1: sheet SE_Diff_RX_06/SE, sheet VGA_B_06/RFOUT
NetC44_14_1: sheet SE_Diff_RX_07/SE, sheet VGA_B_07/RFOUT
NetC68_1_2: sheet PA_A_00/RF_OUT, sheet U_Switch_SPDT/RFC
NetC75_1_2: J_TX_0.S ; sheet U_Switch_SPDT/RF1
NetC75_2_2: J_RX_0.S ; sheet U_Switch_SPDT/RF1
NetC76_1_2: J_gNB_RX.S ; sheet U_Switch_SPDT/RF2
NetC76_2_2: J_gNB_TX.S ; sheet U_Switch_SPDT/RF2
NetC98_1_2: J_TX_1.S ; sheet PMA_01/RFOUT
NetC98_2_2: J_TX_2.S ; sheet PMA_02/RFOUT
NetC98_3_2: J_TX_3.S ; sheet PMA_03/RFOUT
NetC98_4_2: J_TX_4.S ; sheet PMA_04/RFOUT
NetC98_5_2: J_TX_5.S ; sheet PMA_05/RFOUT
NetC98_6_2: J_TX_6.S ; sheet PMA_06/RFOUT
NetC98_7_2: J_TX_7.S ; sheet PMA_07/RFOUT

### Buses and harness runs
harness ATT_CTRL = sheet VGA_A_01/ATT_CTRL
harness ATT_CTRL = sheet VGA_A_02/ATT_CTRL
harness ATT_CTRL = sheet VGA_A_03/ATT_CTRL
harness ATT_CTRL = sheet VGA_A_04/ATT_CTRL
harness ATT_CTRL = sheet VGA_A_05/ATT_CTRL
harness ATT_CTRL = sheet VGA_A_06/ATT_CTRL
harness ATT_CTRL = sheet VGA_A_07/ATT_CTRL
harness ATT_CTRL = sheet VGA_B_01/ATT_CTRL
harness ATT_CTRL = sheet VGA_B_02/ATT_CTRL
harness ATT_CTRL = sheet VGA_B_03/ATT_CTRL
harness ATT_CTRL = sheet VGA_B_04/ATT_CTRL
harness ATT_CTRL = sheet VGA_B_05/ATT_CTRL
harness ATT_CTRL = sheet VGA_B_06/ATT_CTRL
harness ATT_CTRL = sheet VGA_B_07/ATT_CTRL

### Layout directives
differential pair: ADC_00_N, ADC_00_P, ADC_01_N, ADC_01_P, ADC_02_N, ADC_02_P, ADC_03_N, ADC_03_P, ADC_04_N, ADC_04_P, ADC_05_N, ADC_05_P, ADC_06_N, ADC_06_P, ADC_07_N, ADC_07_P, DAC_00_N, DAC_00_P, DAC_01_N, DAC_01_P, DAC_02_N, DAC_02_P, DAC_03_N, DAC_03_P, DAC_04_N, DAC_04_P, DAC_05_N, DAC_05_P, DAC_06_N, DAC_06_P, DAC_07_N, DAC_07_P
net class Diff: ADC_00_N, ADC_00_P, ADC_01_N, ADC_01_P, ADC_02_N, ADC_02_P, ADC_03_N, ADC_03_P, ADC_04_N, ADC_04_P, ADC_05_N, ADC_05_P, ADC_06_N, ADC_06_P, ADC_07_N, ADC_07_P, DAC_00_N, DAC_00_P, DAC_01_N, DAC_01_P, DAC_02_N, DAC_02_P, DAC_03_N, DAC_03_P, DAC_04_N, DAC_04_P, DAC_05_N, DAC_05_P, DAC_06_N, DAC_06_P, DAC_07_N, DAC_07_P
net class GCPW_50: NetC21_1_2, NetC21_2_2, NetC21_3_2, NetC21_4_2, NetC21_5_2, NetC21_6_2, NetC21_7_2, NetC21_8_2, NetC23_16_1, NetC23_17_1, NetC23_18_1, NetC23_19_1, NetC23_20_1, NetC23_21_1, NetC23_22_1, NetC68_1_2, NetC75_1_2, NetC75_2_2, NetC76_1_2, NetC76_2_2, NetC98_1_2, NetC98_2_2, NetC98_3_2, NetC98_4_2, NetC98_5_2, NetC98_6_2, NetC98_7_2

### Notes on the sheet
- 10: RF1
- 01: RF2
- Length match all the TX lines and RX Lines
- Place vias on all major GND pads

### Library data of the parts
J_gNB_RX J_gNB_TX J_RX_0-J_RX_7 J_TX_0-J_TX_7 = SMA Connector SF2921-61345 GCPW 8.8/4: SMA Female Solderless PCB Compression Mount Connector, 2 Hole, with 4.76mm Screws; MF: Samtec; MP: SMA-J-P-H-ST-EM1; Price: None; SnapEDA_Link: https://www.snapeda.com/parts/SMA-J-P-H-ST-EM1/Samtec%20Inc./view-part/?ref=snap; Package: None; Availability: Unavailable; Value: *
SH18 = 2118716-2: MP: 2118728-2; Package: None; Price: None; Value: *; Availability: Unavailable
SH1-SH17 SH19-SH31 = 2118728-2: Package: None; Price: None; Value: *; MP: 2118728-2; Availability: Unavailable

## Sheet Connector_DAC_Side.SchDoc
size B; SheetNumber: 3; SheetTotal: 15
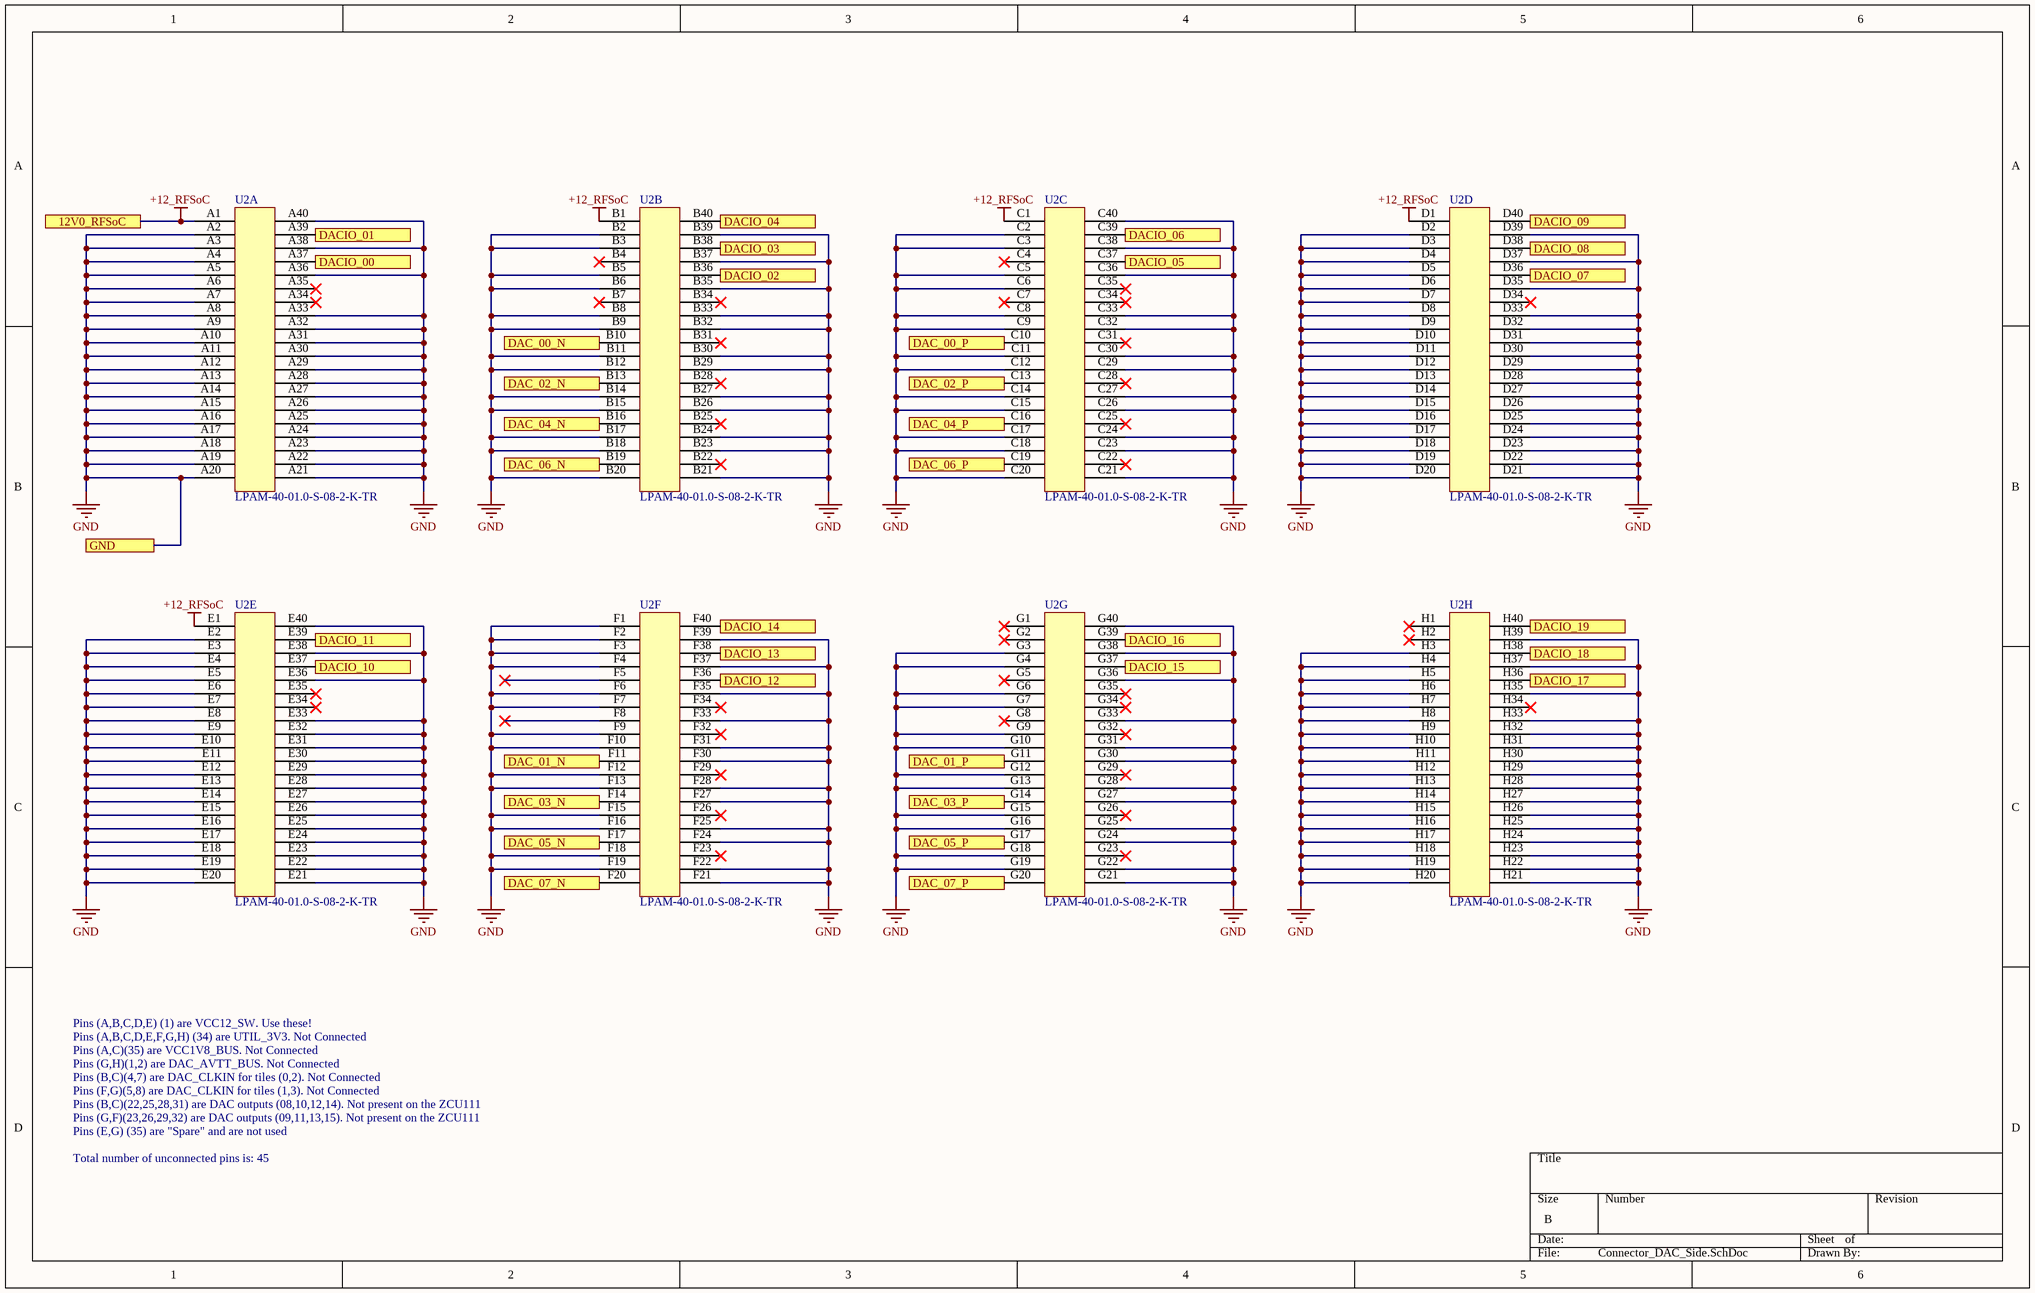
[diagram p4: Connector_DAC_Side.SchDoc]

### Parts
U2  LPAM-40-01.0-S-08-2-K-TR  [LPAM-40-01.5-S-08-2-K-TR]  (parts A,B,C,D,E,F,G,H of 8)

### Ports
12V0_RFSoC, DAC_00_N, DAC_00_P, DAC_01_N, DAC_01_P, DAC_02_N, DAC_02_P, DAC_03_N, DAC_03_P, DAC_04_N, DAC_04_P, DAC_05_N, DAC_05_P, DAC_06_N, DAC_06_P, DAC_07_N, DAC_07_P, DACIO_00, DACIO_01, DACIO_02, DACIO_03, DACIO_04, DACIO_05, DACIO_06, DACIO_07, DACIO_08, DACIO_09, DACIO_10, DACIO_11, DACIO_12, DACIO_13, DACIO_14, DACIO_15, DACIO_16, DACIO_17, DACIO_18, DACIO_19, GND

### Nets
+12_RFSoC: U2.A1 U2.B1 U2.C1 U2.D1 U2.E1 ; port 12V0_RFSoC
GND: U2.A2 U2.A3 U2.A4 U2.A5 U2.A6 U2.A7 U2.A8 U2.A9 U2.A10 U2.A11 U2.A12 U2.A13 U2.A14 U2.A15 U2.A16 U2.A17 U2.A18 U2.A19 U2.A20 U2.A21 U2.A22 U2.A23 U2.A24 U2.A25 U2.A26 U2.A27 U2.A28 U2.A29 U2.A30 U2.A31 U2.A32 U2.A33 U2.A36 U2.A38 U2.A40 U2.B2 U2.B3 U2.B5 U2.B6 U2.B8 U2.B9 U2.B11 U2.B12 U2.B14 U2.B15 U2.B17 U2.B18 U2.B20 U2.B21 U2.B23 U2.B24 U2.B26 U2.B27 U2.B29 U2.B30 U2.B32 U2.B33 U2.B35 U2.B37 U2.B39 U2.C2 U2.C3 U2.C5 U2.C6 U2.C8 U2.C9 U2.C11 U2.C12 U2.C14 U2.C15 U2.C17 U2.C18 U2.C20 U2.C21 U2.C23 U2.C24 U2.C26 U2.C27 U2.C29 U2.C30 U2.C32 U2.C33 U2.C36 U2.C38 U2.C40 U2.D2 U2.D3 U2.D4 U2.D5 U2.D6 U2.D7 U2.D8 U2.D9 U2.D10 U2.D11 U2.D12 U2.D13 U2.D14 U2.D15 U2.D16 U2.D17 U2.D18 U2.D19 U2.D20 U2.D21 U2.D22 U2.D23 U2.D24 U2.D25 U2.D26 U2.D27 U2.D28 U2.D29 U2.D30 U2.D31 U2.D32 U2.D33 U2.D35 U2.D37 U2.D39 U2.E2 U2.E3 U2.E4 U2.E5 U2.E6 U2.E7 U2.E8 U2.E9 U2.E10 U2.E11 U2.E12 U2.E13 U2.E14 U2.E15 U2.E16 U2.E17 U2.E18 U2.E19 U2.E20 U2.E21 U2.E22 U2.E23 U2.E24 U2.E25 U2.E26 U2.E27 U2.E28 U2.E29 U2.E30 U2.E31 U2.E32 U2.E33 U2.E36 U2.E38 U2.E40 U2.F1 U2.F2 U2.F3 U2.F4 U2.F6 U2.F7 U2.F9 U2.F10 U2.F12 U2.F13 U2.F15 U2.F16 U2.F18 U2.F19 U2.F21 U2.F22 U2.F24 U2.F25 U2.F27 U2.F28 U2.F30 U2.F31 U2.F33 U2.F35 U2.F37 U2.F39 U2.G3 U2.G4 U2.G6 U2.G7 U2.G9 U2.G10 U2.G12 U2.G13 U2.G15 U2.G16 U2.G18 U2.G19 U2.G21 U2.G22 U2.G24 U2.G25 U2.G27 U2.G28 U2.G30 U2.G31 U2.G33 U2.G36 U2.G38 U2.G40 U2.H3 U2.H4 U2.H5 U2.H6 U2.H7 U2.H8 U2.H9 U2.H10 U2.H11 U2.H12 U2.H13 U2.H14 U2.H15 U2.H16 U2.H17 U2.H18 U2.H19 U2.H20 U2.H21 U2.H22 U2.H23 U2.H24 U2.H25 U2.H26 U2.H27 U2.H28 U2.H29 U2.H30 U2.H31 U2.H32 U2.H33 U2.H35 U2.H37 U2.H39 ; port GND
DAC_00_N: U2.B10 ; port DAC_00_N
DAC_00_P: U2.C10 ; port DAC_00_P
DAC_01_N: U2.F11 ; port DAC_01_N
DAC_01_P: U2.G11 ; port DAC_01_P
DAC_02_N: U2.B13 ; port DAC_02_N
DAC_02_P: U2.C13 ; port DAC_02_P
DAC_03_N: U2.F14 ; port DAC_03_N
DAC_03_P: U2.G14 ; port DAC_03_P
DAC_04_N: U2.B16 ; port DAC_04_N
DAC_04_P: U2.C16 ; port DAC_04_P
DAC_05_N: U2.F17 ; port DAC_05_N
DAC_05_P: U2.G17 ; port DAC_05_P
DAC_06_N: U2.B19 ; port DAC_06_N
DAC_06_P: U2.C19 ; port DAC_06_P
DAC_07_N: U2.F20 ; port DAC_07_N
DAC_07_P: U2.G20 ; port DAC_07_P
NetU2_A37: U2.A37 ; port DACIO_00
NetU2_A39: U2.A39 ; port DACIO_01
NetU2_B36: U2.B36 ; port DACIO_02
NetU2_B38: U2.B38 ; port DACIO_03
NetU2_B40: U2.B40 ; port DACIO_04
NetU2_C37: U2.C37 ; port DACIO_05
NetU2_C39: U2.C39 ; port DACIO_06
NetU2_D36: U2.D36 ; port DACIO_07
NetU2_D38: U2.D38 ; port DACIO_08
NetU2_D40: U2.D40 ; port DACIO_09
NetU2_E37: U2.E37 ; port DACIO_10
NetU2_E39: U2.E39 ; port DACIO_11
NetU2_F36: U2.F36 ; port DACIO_12
NetU2_F38: U2.F38 ; port DACIO_13
NetU2_F40: U2.F40 ; port DACIO_14
NetU2_G37: U2.G37 ; port DACIO_15
NetU2_G39: U2.G39 ; port DACIO_16
NetU2_H36: U2.H36 ; port DACIO_17
NetU2_H38: U2.H38 ; port DACIO_18
NetU2_H40: U2.H40 ; port DACIO_19

Not connected (* = marked no-connect by the designer): U2 A34* A35* B4* B7* B22* B25* B28* B31* B34* C4* C7* C22* C25* C28* C31* C34* C35* D34* E34* E35* F5* F8* F23* F26* F29* F32* F34* G1* G2* G5* G8* G23* G26* G29* G32* G34* G35* H1* H2* H34*

### Notes on the sheet
- Pins (A,B,C,D,E) (1) are VCC12_SW. Use these!
- Pins (A,B,C,D,E,F,G,H) (34) are UTIL_3V3. Not Connected
- Pins (A,C)(35) are VCC1V8_BUS. Not Connected
- Pins (G,H)(1,2) are DAC_AVTT_BUS. Not Connected
- Pins (B,C)(4,7) are DAC_CLKIN for tiles (0,2). Not Connected
- Pins (F,G)(5,8) are DAC_CLKIN for tiles (1,3). Not Connected
- Pins (B,C)(22,25,28,31) are DAC outputs (08,10,12,14). Not present on the ZCU111
- Pins (G,F)(23,26,29,32) are DAC outputs (09,11,13,15). Not present on the ZCU111
- Total number of unconnected pins is: 45
- Pins (E,G) (35) are "Spare" and are not used

### Library data of the parts
U2 = LPAM-40-01.5-S-08-2-K-TR: .050" LP Array™ High-Speed High-Density Low Profile Open-Pin-Field Array, Terminal

## Sheet Connector_ADC_Side.SchDoc
size B; Author: AVD; CompanyName: Pi-Radio; SheetNumber: 2; SheetTotal: 13
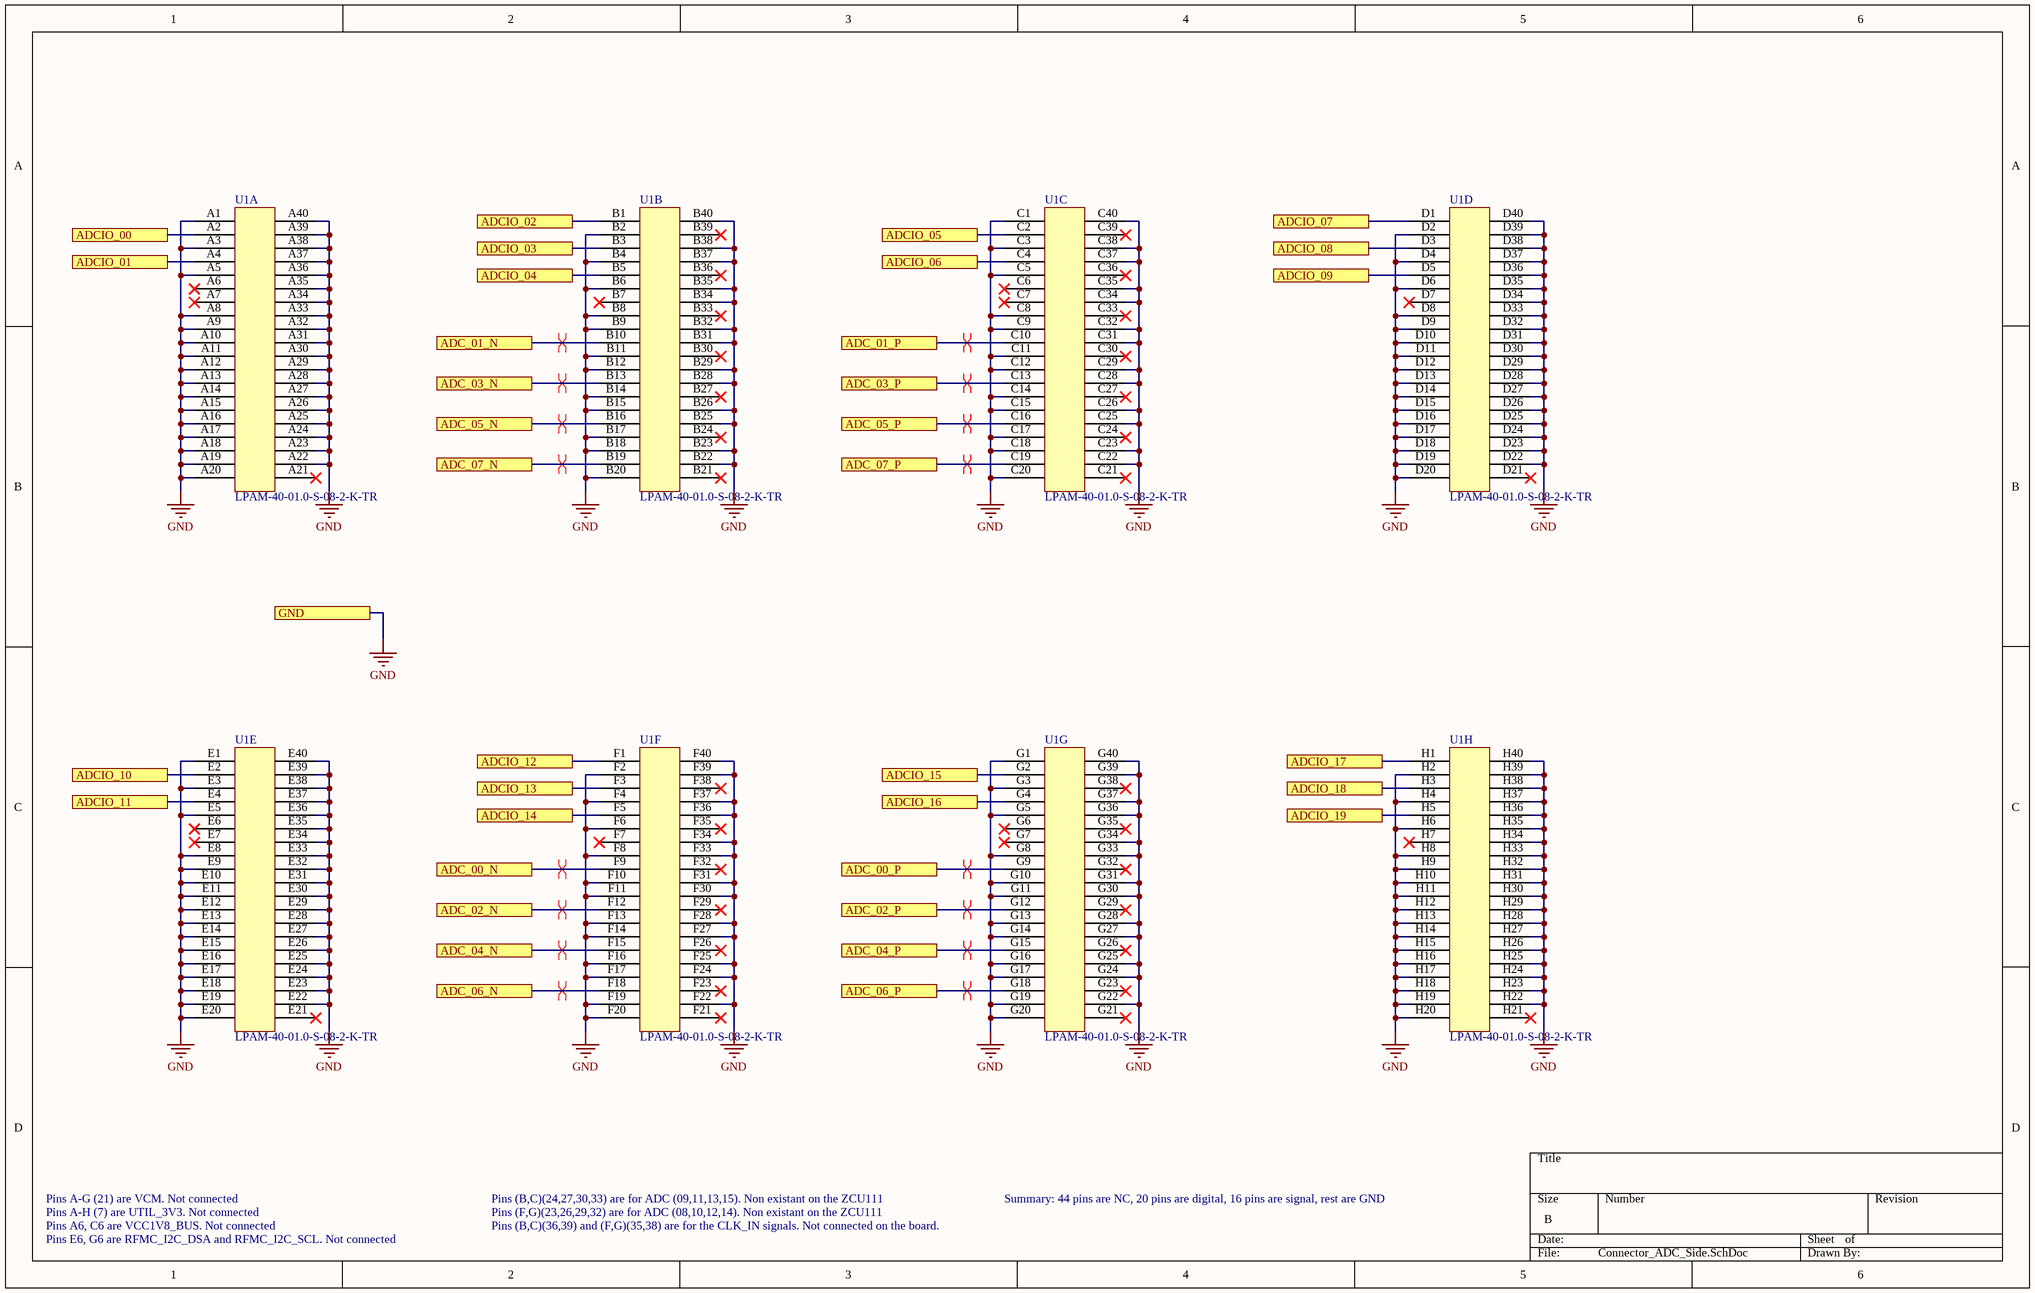
[diagram p5: Connector_ADC_Side.SchDoc]

### Parts
U1  LPAM-40-01.0-S-08-2-K-TR  [LPAM-40-01.5-S-08-2-K-TR]  (parts A,B,C,D,E,F,G,H of 8)

### Ports
ADC_00_N, ADC_00_P, ADC_01_N, ADC_01_P, ADC_02_N, ADC_02_P, ADC_03_N, ADC_03_P, ADC_04_N, ADC_04_P, ADC_05_N, ADC_05_P, ADC_06_N, ADC_06_P, ADC_07_N, ADC_07_P, ADCIO_00, ADCIO_01, ADCIO_02, ADCIO_03, ADCIO_04, ADCIO_05, ADCIO_06, ADCIO_07, ADCIO_08, ADCIO_09, ADCIO_10, ADCIO_11, ADCIO_12, ADCIO_13, ADCIO_14, ADCIO_15, ADCIO_16, ADCIO_17, ADCIO_18, ADCIO_19, GND

### Nets
GND: U1.A1 U1.A3 U1.A5 U1.A8 U1.A9 U1.A10 U1.A11 U1.A12 U1.A13 U1.A14 U1.A15 U1.A16 U1.A17 U1.A18 U1.A19 U1.A20 U1.A22 U1.A23 U1.A24 U1.A25 U1.A26 U1.A27 U1.A28 U1.A29 U1.A30 U1.A31 U1.A32 U1.A33 U1.A34 U1.A35 U1.A36 U1.A37 U1.A38 U1.A39 U1.A40 U1.B2 U1.B4 U1.B6 U1.B8 U1.B9 U1.B11 U1.B12 U1.B14 U1.B15 U1.B17 U1.B18 U1.B20 U1.B22 U1.B23 U1.B25 U1.B26 U1.B28 U1.B29 U1.B31 U1.B32 U1.B34 U1.B35 U1.B37 U1.B38 U1.B40 U1.C1 U1.C3 U1.C5 U1.C8 U1.C9 U1.C11 U1.C12 U1.C14 U1.C15 U1.C17 U1.C18 U1.C20 U1.C22 U1.C23 U1.C25 U1.C26 U1.C28 U1.C29 U1.C31 U1.C32 U1.C34 U1.C35 U1.C37 U1.C38 U1.C40 U1.D2 U1.D4 U1.D6 U1.D8 U1.D9 U1.D10 U1.D11 U1.D12 U1.D13 U1.D14 U1.D15 U1.D16 U1.D17 U1.D18 U1.D19 U1.D20 U1.D22 U1.D23 U1.D24 U1.D25 U1.D26 U1.D27 U1.D28 U1.D29 U1.D30 U1.D31 U1.D32 U1.D33 U1.D34 U1.D35 U1.D36 U1.D37 U1.D38 U1.D39 U1.D40 U1.E1 U1.E3 U1.E5 U1.E8 U1.E9 U1.E10 U1.E11 U1.E12 U1.E13 U1.E14 U1.E15 U1.E16 U1.E17 U1.E18 U1.E19 U1.E20 U1.E22 U1.E23 U1.E24 U1.E25 U1.E26 U1.E27 U1.E28 U1.E29 U1.E30 U1.E31 U1.E32 U1.E33 U1.E34 U1.E35 U1.E36 U1.E37 U1.E38 U1.E39 U1.E40 U1.F2 U1.F4 U1.F6 U1.F8 U1.F10 U1.F11 U1.F13 U1.F14 U1.F16 U1.F17 U1.F19 U1.F20 U1.F22 U1.F24 U1.F25 U1.F27 U1.F28 U1.F30 U1.F31 U1.F33 U1.F34 U1.F36 U1.F37 U1.F39 U1.F40 U1.G1 U1.G3 U1.G5 U1.G8 U1.G10 U1.G11 U1.G13 U1.G14 U1.G16 U1.G17 U1.G19 U1.G20 U1.G22 U1.G24 U1.G25 U1.G27 U1.G28 U1.G30 U1.G31 U1.G33 U1.G34 U1.G36 U1.G37 U1.G39 U1.G40 U1.H2 U1.H4 U1.H6 U1.H8 U1.H9 U1.H10 U1.H11 U1.H12 U1.H13 U1.H14 U1.H15 U1.H16 U1.H17 U1.H18 U1.H19 U1.H20 U1.H22 U1.H23 U1.H24 U1.H25 U1.H26 U1.H27 U1.H28 U1.H29 U1.H30 U1.H31 U1.H32 U1.H33 U1.H34 U1.H35 U1.H36 U1.H37 U1.H38 U1.H39 U1.H40 ; port GND
ADC_00_N: U1.F9 ; port ADC_00_N
ADC_00_P: U1.G9 ; port ADC_00_P
ADC_01_N: U1.B10 ; port ADC_01_N
ADC_01_P: U1.C10 ; port ADC_01_P
ADC_02_N: U1.F12 ; port ADC_02_N
ADC_02_P: U1.G12 ; port ADC_02_P
ADC_03_N: U1.B13 ; port ADC_03_N
ADC_03_P: U1.C13 ; port ADC_03_P
ADC_04_N: U1.F15 ; port ADC_04_N
ADC_04_P: U1.G15 ; port ADC_04_P
ADC_05_N: U1.B16 ; port ADC_05_N
ADC_05_P: U1.C16 ; port ADC_05_P
ADC_06_N: U1.F18 ; port ADC_06_N
ADC_06_P: U1.G18 ; port ADC_06_P
ADC_07_N: U1.B19 ; port ADC_07_N
ADC_07_P: U1.C19 ; port ADC_07_P
ATT_CTRL.D0: U1.F1 ; port ADCIO_12
ATT_CTRL.D1: U1.E4 ; port ADCIO_11
ATT_CTRL.D2: U1.E2 ; port ADCIO_10
ATT_CTRL.D3: U1.D5 ; port ADCIO_09
ATT_CTRL.D4: U1.D3 ; port ADCIO_08
ATT_CTRL.D5: U1.D1 ; port ADCIO_07
CTRL2: U1.H5 ; port ADCIO_19
RX_MAIN_ENb_1V8: U1.B5 ; port ADCIO_04
RX_REF_ENb_1V8: U1.B3 ; port ADCIO_03
TRIG_IN_1V8: U1.H3 ; port ADCIO_18
TX_MAIN_ENb_1V8: U1.B1 ; port ADCIO_02
TX_REF_ENb_1V8: U1.A4 ; port ADCIO_01
NetU1_A2: U1.A2 ; port ADCIO_00
NetU1_C2: U1.C2 ; port ADCIO_05
NetU1_C4: U1.C4 ; port ADCIO_06
NetU1_F3: U1.F3 ; port ADCIO_13
NetU1_F5: U1.F5 ; port ADCIO_14
NetU1_G2: U1.G2 ; port ADCIO_15
NetU1_G4: U1.G4 ; port ADCIO_16
NetU1_H1: U1.H1 ; port ADCIO_17

Not connected (* = marked no-connect by the designer): U1 A6* A7* A21* B7* B21* B24* B27* B30* B33* B36* B39* C6* C7* C21* C24* C27* C30* C33* C36* C39* D7* D21* E6* E7* E21* F7* F21* F23* F26* F29* F32* F35* F38* G6* G7* G21* G23* G26* G29* G32* G35* G38* H7* H21*

### Layout directives
differential pair: ADC_00_N, ADC_00_P, ADC_01_N, ADC_01_P, ADC_02_N, ADC_02_P, ADC_03_N, ADC_03_P, ADC_04_N, ADC_04_P, ADC_05_N, ADC_05_P, ADC_06_N, ADC_06_P, ADC_07_N, ADC_07_P

### Notes on the sheet
- Pins A-G (21) are VCM. Not connected
- Pins A-H (7) are UTIL_3V3. Not connected
- Pins A6, C6 are VCC1V8_BUS. Not connected
- Pins E6, G6 are RFMC_I2C_DSA and RFMC_I2C_SCL. Not connected
- Pins (B,C)(24,27,30,33) are for ADC (09,11,13,15). Non existant on the ZCU111
- Pins (F,G)(23,26,29,32) are for ADC (08,10,12,14). Non existant on the ZCU111
- Pins (B,C)(36,39) and (F,G)(35,38) are for the CLK_IN signals. Not connected on the board.
- Summary: 44 pins are NC, 20 pins are digital, 16 pins are signal, rest are GND

### Library data of the parts
U1 = LPAM-40-01.5-S-08-2-K-TR: as U2 on sheet Connector_DAC_Side

## Sheet RX_LNA.SchDoc
size B; SheetNumber: 5; SheetTotal: 14
Used 22 times, as channels RX_LNA_A_01, RX_LNA_A_02, RX_LNA_A_03, RX_LNA_A_04, RX_LNA_A_05, RX_LNA_A_06, RX_LNA_A_07, RX_LNA_A_00, RX_LNA_B_01, RX_LNA_B_02, RX_LNA_B_03, RX_LNA_B_04, RX_LNA_B_05, RX_LNA_B_06, RX_LNA_B_07, TX_Final_Amp_01, TX_Final_Amp_02, TX_Final_Amp_03, TX_Final_Amp_04, TX_Final_Amp_05, TX_Final_Amp_06, TX_Final_Amp_07. Parts and nets are listed once, with the designators drawn on the sheet.
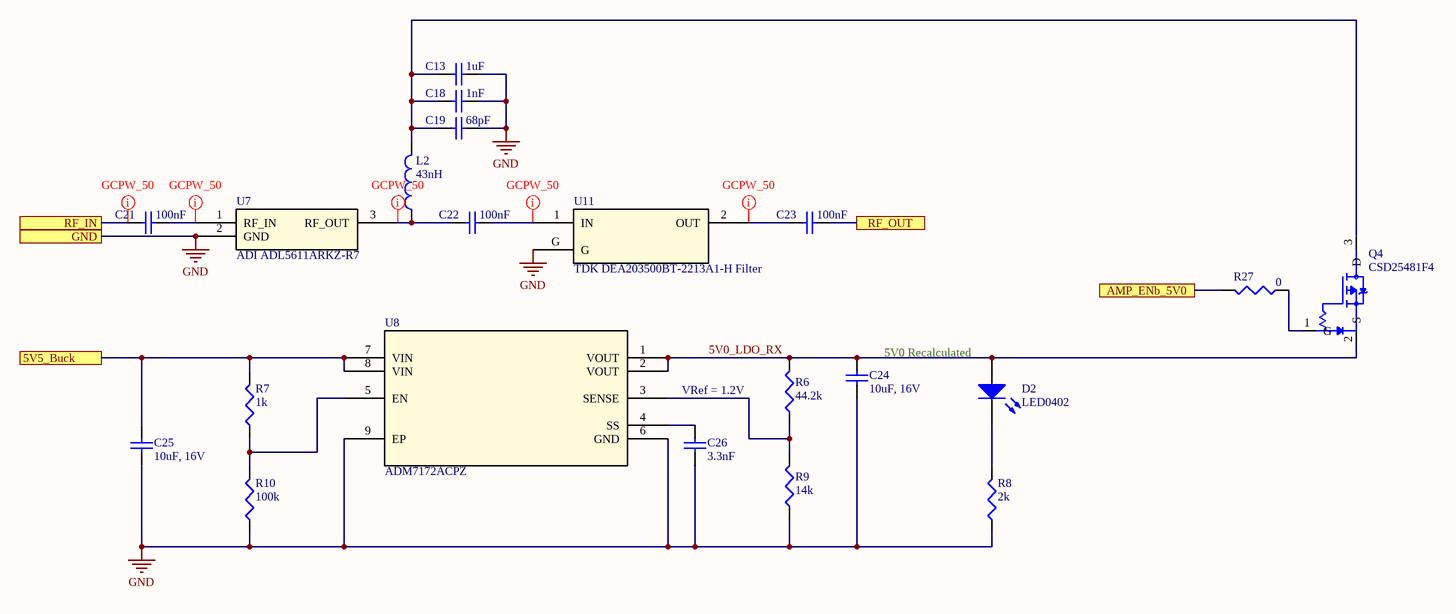
[diagram p6: RX_LNA.SchDoc]

### Parts
C13  1uF  [SMD-0402]
C18  1nF  [SMD-0402]
C19  68pF  [SMD-0402]
C21  100nF  [SMD-0402]
C22  100nF  [SMD-0402]
C23  100nF  [SMD-0402]
C24  10uF, 16V  [SMD-0603]
C25  10uF, 16V  [SMD-0603]
C26  3.3nF  [Johanson-0201]
D2  LED0402  [LED-0402]
L2  43nH  [SMD-0603]
Q4  CSD25481F4  [CSD25481F4]
R6  44.2k  [SMD-0402]
R7  1k  [SMD-0402]
R8  2k  [SMD-0402]
R9  14k  [SMD-0402]
R10  100k  [SMD-0402]
R27  0  [SMD-0402]
U7  ADI ADL5611ARKZ-R7  [Analog Devices ADL5545ARKZ]
U8  ADM7172ACPZ  [ADM7172_VIA_NOSILK]
U11  TDK DEA203500BT-2213A1-H Filter  [TDK DEA203500BT-2213A1-H Bandpass Filter]

### Ports
5V5_Buck, AMP_ENb_5V0, GND, RF_IN, RF_OUT

### Nets
GND: C13.1 C18.1 C19.1 C24.1 C25.1 C26.1 R8.1 R9.1 R10.1 U7.2(GND) U8.6(GND) U8.9(EP) U11.G ; port GND
5V0_LDO_RX: C24.2 D2.2(A) Q4.2(S) R6.2 U8.1(VOUT) U8.2(VOUT)
5V5_Buck: C25.2 R7.2 U8.7(VIN) U8.8(VIN) ; port 5V5_Buck
AMP_ENb_5V0: R27.2 ; port AMP_ENb_5V0
RF_IN: C21.2 ; port RF_IN
RF_OUT: C23.1 ; port RF_OUT
NetC13_2: C13.2 C18.2 C19.2 L2.2 Q4.3(D)
NetC21_1: C21.1 U7.1(RF_IN)
NetC22_1: C22.1 U11.1(IN)
NetC22_2: C22.2 L2.1 U7.3(RF_OUT)
NetC23_2: C23.2 U11.2(OUT)
NetC26_2: C26.2 U8.4(SS)
NetD2_1: D2.1(K) R8.2
NetQ4_1: Q4.1(G) R27.1
NetR6_1: R6.1 R9.2 U8.3(SENSE)
NetR7_1: R7.1 R10.2 U8.5(EN)

### Channels
RX_LNA_A_01: designators end in _1; ports 5V5_Buck=5V5_B AMP_ENb_5V0=RX_MAIN_ENb GND=GND RF_IN=NetC21_1_2 RF_OUT=NetC23_1_1
RX_LNA_A_02: designators end in _2; ports 5V5_Buck=5V5_B AMP_ENb_5V0=RX_MAIN_ENb GND=GND RF_IN=NetC21_2_2 RF_OUT=NetC23_2_1
RX_LNA_A_03: designators end in _3; ports 5V5_Buck=5V5_B AMP_ENb_5V0=RX_MAIN_ENb GND=GND RF_IN=NetC21_3_2 RF_OUT=NetC23_3_1
RX_LNA_A_04: designators end in _4; ports 5V5_Buck=5V5_B AMP_ENb_5V0=RX_MAIN_ENb GND=GND RF_IN=NetC21_4_2 RF_OUT=NetC23_4_1
RX_LNA_A_05: designators end in _5; ports 5V5_Buck=5V5_B AMP_ENb_5V0=RX_MAIN_ENb GND=GND RF_IN=NetC21_5_2 RF_OUT=NetC23_5_1
RX_LNA_A_06: designators end in _6; ports 5V5_Buck=5V5_B AMP_ENb_5V0=RX_MAIN_ENb GND=GND RF_IN=NetC21_6_2 RF_OUT=NetC23_6_1
RX_LNA_A_07: designators end in _7; ports 5V5_Buck=5V5_B AMP_ENb_5V0=RX_MAIN_ENb GND=GND RF_IN=NetC21_7_2 RF_OUT=NetC23_7_1
RX_LNA_A_00: designators end in _8; ports 5V5_Buck=5V5_C AMP_ENb_5V0=RX_REF_ENb GND=GND RF_IN=NetC21_8_2 RF_OUT=NetC23_8_1
RX_LNA_B_01: designators end in _9; ports 5V5_Buck=5V5_C AMP_ENb_5V0=RX_MAIN_ENb GND=GND RF_IN=NetC21_9_2 RF_OUT=NetC23_9_1
RX_LNA_B_02: designators end in _10; ports 5V5_Buck=5V5_C AMP_ENb_5V0=RX_MAIN_ENb GND=GND RF_IN=NetC21_10_2 RF_OUT=NetC23_10_1
RX_LNA_B_03: designators end in _11; ports 5V5_Buck=5V5_C AMP_ENb_5V0=RX_MAIN_ENb GND=GND RF_IN=NetC21_11_2 RF_OUT=NetC23_11_1
RX_LNA_B_04: designators end in _12; ports 5V5_Buck=5V5_C AMP_ENb_5V0=RX_MAIN_ENb GND=GND RF_IN=NetC21_12_2 RF_OUT=NetC23_12_1
RX_LNA_B_05: designators end in _13; ports 5V5_Buck=5V5_C AMP_ENb_5V0=RX_MAIN_ENb GND=GND RF_IN=NetC21_13_2 RF_OUT=NetC23_13_1
RX_LNA_B_06: designators end in _14; ports 5V5_Buck=5V5_C AMP_ENb_5V0=RX_MAIN_ENb GND=GND RF_IN=NetC21_14_2 RF_OUT=NetC23_14_1
RX_LNA_B_07: designators end in _15; ports 5V5_Buck=5V5_C AMP_ENb_5V0=RX_MAIN_ENb GND=GND RF_IN=NetC21_15_2 RF_OUT=NetC23_15_1
TX_Final_Amp_01: designators end in _16; ports 5V5_Buck=5V5_A AMP_ENb_5V0=TX_MAIN_ENb GND=GND RF_IN=NetC21_16_2 RF_OUT=NetC23_16_1
TX_Final_Amp_02: designators end in _17; ports 5V5_Buck=5V5_A AMP_ENb_5V0=TX_MAIN_ENb GND=GND RF_IN=NetC21_17_2 RF_OUT=NetC23_17_1
TX_Final_Amp_03: designators end in _18; ports 5V5_Buck=5V5_A AMP_ENb_5V0=TX_MAIN_ENb GND=GND RF_IN=NetC21_18_2 RF_OUT=NetC23_18_1
TX_Final_Amp_04: designators end in _19; ports 5V5_Buck=5V5_A AMP_ENb_5V0=TX_MAIN_ENb GND=GND RF_IN=NetC21_19_2 RF_OUT=NetC23_19_1
TX_Final_Amp_05: designators end in _20; ports 5V5_Buck=5V5_A AMP_ENb_5V0=TX_MAIN_ENb GND=GND RF_IN=NetC21_20_2 RF_OUT=NetC23_20_1
TX_Final_Amp_06: designators end in _21; ports 5V5_Buck=5V5_A AMP_ENb_5V0=TX_MAIN_ENb GND=GND RF_IN=NetC21_21_2 RF_OUT=NetC23_21_1
TX_Final_Amp_07: designators end in _22; ports 5V5_Buck=5V5_A AMP_ENb_5V0=TX_MAIN_ENb GND=GND RF_IN=NetC21_22_2 RF_OUT=NetC23_22_1

### Layout directives
net class GCPW_50: NetC21_1_1, NetC21_1_2, NetC22_1_1, NetC22_1_2, NetC23_1_2

### Notes on the sheet
- 5V0 Recalculated
- VRef = 1.2V

### Library data of the parts
C13 C18 C19 C21-C23 = CAP0402: Ceramic Capacitor 0402
C24 C25 = CAP0603: Ceramic Capacitor 0603
C26 = CAP0201: Capacitor 0201 Imperial
D2 = LED0402: LED 0402
L2 = L0603: Inductor 0603
Q4 = CSD25481F4: -20V, P ch NexFET MOSFET, single LGA 0.6x1.0, 105mOhm 3-PICOSTAR -55 to 150; MF: Texas Instruments; MP: CSD25481F4; Purchase-URL: https://pricing.snapeda.com/search/part/CSD25481F4/?ref=eda; Price: None; SnapEDA_Link: https://www.snapeda.com/parts/CSD25481F4/Texas%20Instruments/view-part/808987/?ref=snap; Check_prices: https://www.snapeda.com/parts/CSD25481F4/Texas%20Instruments/view-part/808987/?ref=eda; Package: PICOSTAR-3 Texas Instruments; Availability: Good; Value: *
R6-R10 R27 = RES0402: Resistor-0402
U7 = ADI ADL5611ARKZ-R7: IC AMP W-CDMA 30MHZ-6GHZ SOT89-3; Mfr_Name: Analog Devices Inc; RefDes: RefDes; Type: Type
U8 = ADM7172ACPZ: 6.5V, 2A, Ultralow Noise, High PSRR, Fast Transient Response CMOS LDO; Value: Value; Type: Type; RefDes: RefDes
U11 = TDK DEA203500BT-2213A1-H Filter: 3.5 GHz Center Freq BPF; Mfr_Name: TDK; RefDes: RefDes; Type: Type

## Sheet TX_PA.SchDoc
size B; SheetNumber: 4; SheetTotal: 12
Used 8 times, as channels TX_PA_00, TX_PA_01, TX_PA_02, TX_PA_03, TX_PA_04, TX_PA_05, TX_PA_06, TX_PA_07. Parts and nets are listed once, with the designators drawn on the sheet.
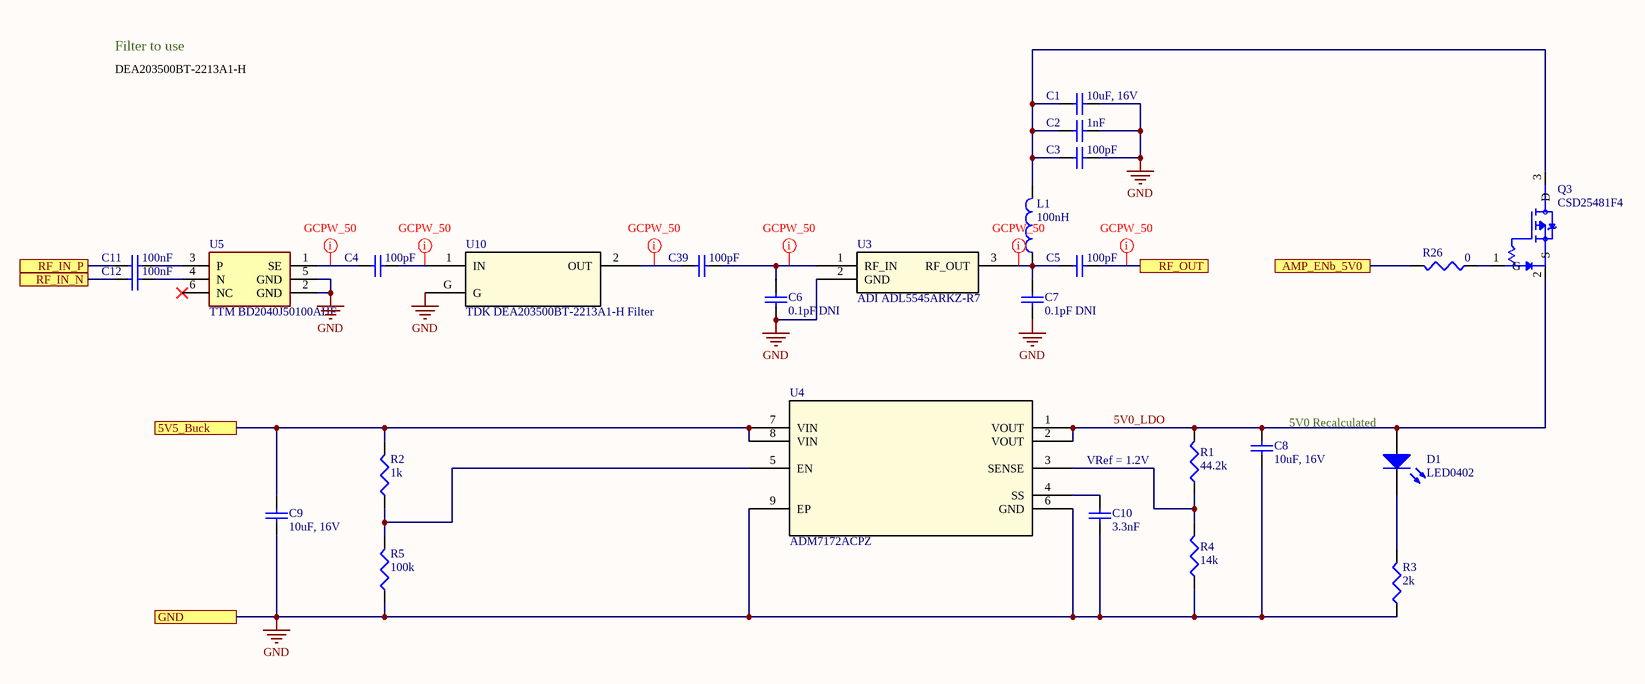
[diagram p7: TX_PA.SchDoc]

### Parts
C1  10uF, 16V  [SMD-0603]
C2  1nF  [SMD-0402]
C3  100pF  [SMD-0402]
C4  100pF  [SMD-0402]
C5  100pF  [SMD-0402]
C6  0.1pF DNI  [SMD-0402]
C7  0.1pF DNI  [SMD-0402]
C8  10uF, 16V  [SMD-0603]
C9  10uF, 16V  [SMD-0603]
C10  3.3nF  [Johanson-0201]
C11  100nF  [SMD-0402]
C12  100nF  [SMD-0402]
C39  100pF  [SMD-0402]
D1  LED0402  [LED-0402]
L1  100nH  [SMD-0402]
Q3  CSD25481F4  [CSD25481F4]
R1  44.2k  [SMD-0402]
R2  1k  [SMD-0402]
R3  2k  [SMD-0402]
R4  14k  [SMD-0402]
R5  100k  [SMD-0402]
R26  0  [SMD-0402]
U3  ADI ADL5545ARKZ-R7  [Analog Devices ADL5545ARKZ]
U4  ADM7172ACPZ  [ADM7172_VIA_NOSILK]
U5  TTM BD2040J50100AHF  [Anaren Balun BD2040J50100AHF]
U10  TDK DEA203500BT-2213A1-H Filter  [TDK DEA203500BT-2213A1-H Bandpass Filter]

### Ports
5V5_Buck, AMP_ENb_5V0, GND, RF_IN_N, RF_IN_P, RF_OUT

### Nets
GND: C1.1 C2.2 C3.2 C6.1 C7.1 C8.1 C9.1 C10.1 R3.1 R4.1 R5.1 U3.2(GND) U4.6(GND) U4.9(EP) U5.2(GND) U5.5(GND) U10.G ; port GND
5V0_LDO: C8.2 D1.2(A) Q3.2(S) R1.2 U4.1(VOUT) U4.2(VOUT)
5V5_Buck: C9.2 R2.2 U4.7(VIN) U4.8(VIN) ; port 5V5_Buck
AMP_ENb_5V0: R26.2 ; port AMP_ENb_5V0
RF_IN_N: C12.1 ; port RF_IN_N
RF_IN_P: C11.1 ; port RF_IN_P
RF_OUT: C5.2 ; port RF_OUT
NetC1_2: C1.2 C2.1 C3.1 L1.2 Q3.3(D)
NetC4_1: C4.1 U5.1(SE)
NetC4_2: C4.2 U10.1(IN)
NetC5_1: C5.1 C7.2 L1.1 U3.3(RF_OUT)
NetC6_2: C6.2 C39.2 U3.1(RF_IN)
NetC10_2: C10.2 U4.4(SS)
NetC11_2: C11.2 U5.3(P)
NetC12_2: C12.2 U5.4(N)
NetC39_1: C39.1 U10.2(OUT)
NetD1_1: D1.1(K) R3.2
NetQ3_1: Q3.1(G) R26.1
NetR1_1: R1.1 R4.2 U4.3(SENSE)
NetR2_1: R2.1 R5.2 U4.5(EN)

Not connected (* = marked no-connect by the designer): U5 6(NC)*

### Channels
TX_PA_00: designators end in _1; ports 5V5_Buck=5V5_A AMP_ENb_5V0=TX_REF_ENb GND=GND RF_IN_N=DAC_00_N RF_IN_P=DAC_00_P RF_OUT=NetC5_1_2
TX_PA_01: designators end in _2; ports 5V5_Buck=5V5_A AMP_ENb_5V0=TX_MAIN_ENb GND=GND RF_IN_N=DAC_01_N RF_IN_P=DAC_01_P RF_OUT=NetC5_2_2
TX_PA_02: designators end in _3; ports 5V5_Buck=5V5_A AMP_ENb_5V0=TX_MAIN_ENb GND=GND RF_IN_N=DAC_02_N RF_IN_P=DAC_02_P RF_OUT=NetC5_3_2
TX_PA_03: designators end in _4; ports 5V5_Buck=5V5_A AMP_ENb_5V0=TX_MAIN_ENb GND=GND RF_IN_N=DAC_03_N RF_IN_P=DAC_03_P RF_OUT=NetC5_4_2
TX_PA_04: designators end in _5; ports 5V5_Buck=5V5_A AMP_ENb_5V0=TX_MAIN_ENb GND=GND RF_IN_N=DAC_04_N RF_IN_P=DAC_04_P RF_OUT=NetC5_5_2
TX_PA_05: designators end in _6; ports 5V5_Buck=5V5_A AMP_ENb_5V0=TX_MAIN_ENb GND=GND RF_IN_N=DAC_05_N RF_IN_P=DAC_05_P RF_OUT=NetC5_6_2
TX_PA_06: designators end in _7; ports 5V5_Buck=5V5_A AMP_ENb_5V0=TX_MAIN_ENb GND=GND RF_IN_N=DAC_06_N RF_IN_P=DAC_06_P RF_OUT=NetC5_7_2
TX_PA_07: designators end in _8; ports 5V5_Buck=5V5_A AMP_ENb_5V0=TX_MAIN_ENb GND=GND RF_IN_N=DAC_07_N RF_IN_P=DAC_07_P RF_OUT=NetC5_8_2

### Layout directives
net class GCPW_50: NetC4_1_1, NetC4_1_2, NetC5_1_1, NetC5_1_2, NetC6_1_2, NetC39_1_1

### Notes on the sheet
- DEA203500BT-2213A1-H
- Filter to use
- 5V0 Recalculated
- VRef = 1.2V

### Library data of the parts
C1 C8 C9 = CAP0603: Ceramic Capacitor 0603
C2-C7 C11 C12 C39 = CAP0402: Ceramic Capacitor 0402
C10 = CAP0201: Capacitor 0201 Imperial
D1 = LED0402: LED 0402
L1 = L0402: Inductor 0402
Q3 = CSD25481F4: as Q4 on sheet RX_LNA; MP: CSD25481F4; Purchase-URL: https://pricing.snapeda.com/search/part/CSD25481F4/?ref=eda; Price: None; SnapEDA_Link: https://www.snapeda.com/parts/CSD25481F4/Texas%20Instruments/view-part/808987/?ref=snap; Check_prices: https://www.snapeda.com/parts/CSD25481F4/Texas%20Instruments/view-part/808987/?ref=eda; Package: PICOSTAR-3 Texas Instruments; Availability: Good; Value: *
R1-R5 R26 = RES0402: Resistor-0402
U3 = ADI ADL5545ARKZ-R7: No Description Available; Mfr_Name: Analog Devices Inc; RefDes: RefDes; Type: Type
U4 = ADM7172ACPZ: as U8 on sheet RX_LNA; Value: Value; Type: Type; RefDes: RefDes
U5 = Anaren Balun - BD2040J50100AHF: Filter; Manufacturer_Name: ANAREN; Datasheet Link: https://cdn.anaren.com/product-documents/Xinger/BalunTransformers/BD2040J50100AHF/BD2040J50100AHF_DataSheet(Rev_C).pdf; Height: 0.78mm; Manufacturer_Part_Number: BD2040J50100AHF; Mouser Part Number: 620-BD2040J50100AH; Mouser Price/Stock: https://www.mouser.co.uk/ProductDetail/Anaren/BD2040J50100AHF?qs=BDRISUKNLIfZZVKLkyHFlw%3D%3D
U10 = TDK DEA203500BT-2213A1-H Filter: 3.5 GHz Center Freq BPF; Mfr_Name: TDK; RefDes: RefDes; Type: Type

## Sheet Power.SchDoc
size A; SheetNumber: 6; SheetTotal: 17
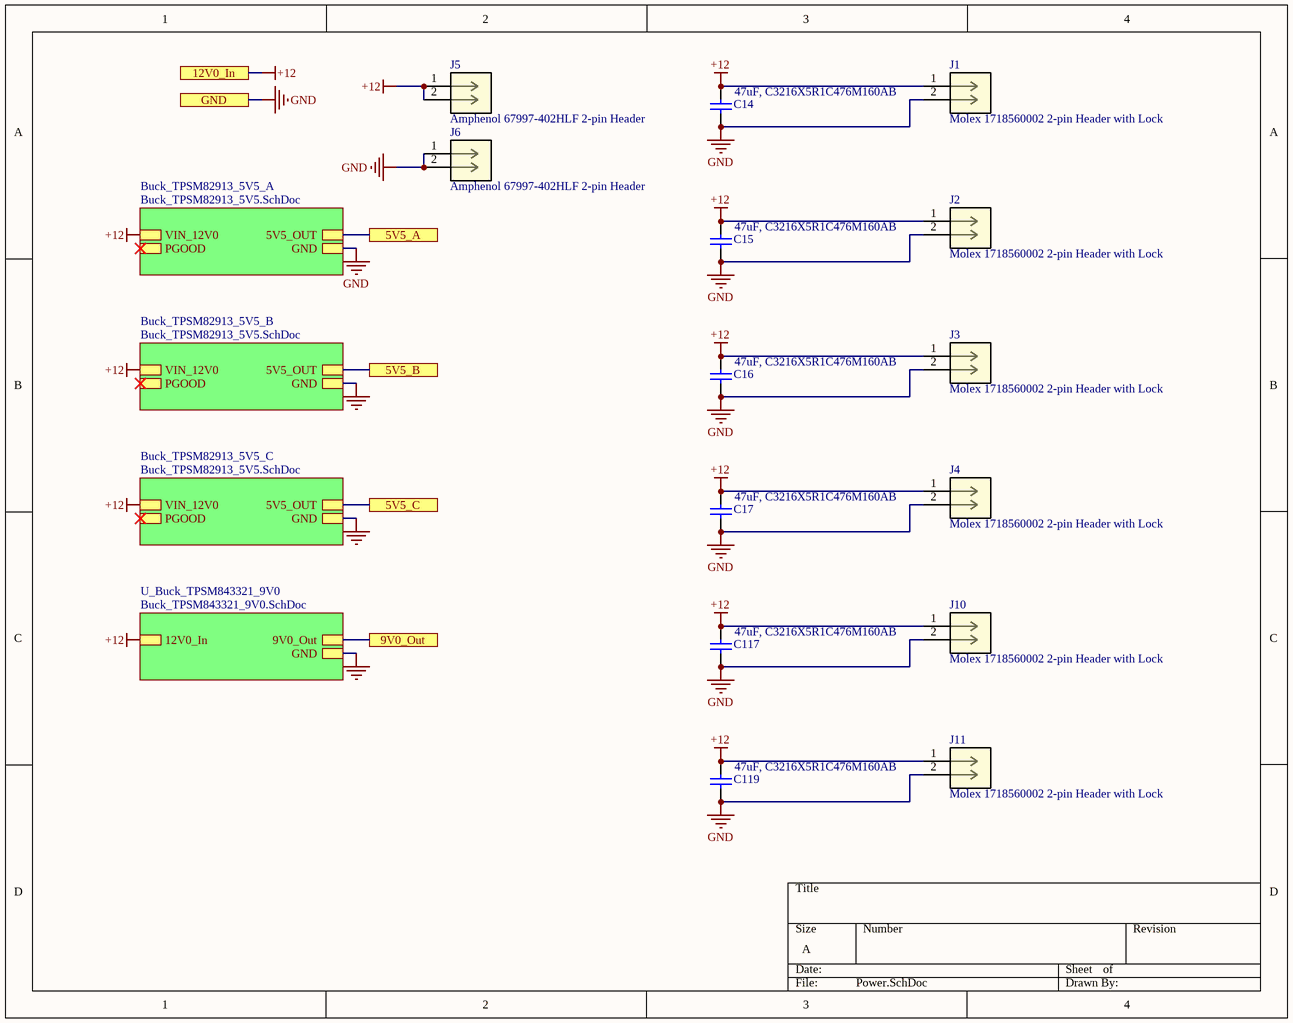
[diagram p8: Power.SchDoc]

### Parts
C14  47uF, C3216X5R1C476M160AB  [SMD-1206]
C15  47uF, C3216X5R1C476M160AB  [SMD-1206]
C16  47uF, C3216X5R1C476M160AB  [SMD-1206]
C17  47uF, C3216X5R1C476M160AB  [SMD-1206]
C117  47uF, C3216X5R1C476M160AB  [SMD-1206]
C119  47uF, C3216X5R1C476M160AB  [SMD-1206]
J1  Molex 1718560002 2-pin Header with Lock  [Molex 1718560002 2-pin header with lock]
J2  Molex 1718560002 2-pin Header with Lock  [Molex 1718560002 2-pin header with lock]
J3  Molex 1718560002 2-pin Header with Lock  [Molex 1718560002 2-pin header with lock]
J4  Molex 1718560002 2-pin Header with Lock  [Molex 1718560002 2-pin header with lock]
J5  Amphenol 67997-402HLF 2-pin Header  [Amphenol  67997-402HLF 2-pin header]
J6  Amphenol 67997-402HLF 2-pin Header  [Amphenol  67997-402HLF 2-pin header]
J10  Molex 1718560002 2-pin Header with Lock  [Molex 1718560002 2-pin header with lock]
J11  Molex 1718560002 2-pin Header with Lock  [Molex 1718560002 2-pin header with lock]

### Sub-sheets
Buck_TPSM82913_5V5_A = Buck_TPSM82913_5V5.SchDoc: GND, VIN_12V0, PGOOD, 5V5_OUT
Buck_TPSM82913_5V5_B = Buck_TPSM82913_5V5.SchDoc: GND, VIN_12V0, PGOOD, 5V5_OUT
Buck_TPSM82913_5V5_C = Buck_TPSM82913_5V5.SchDoc: GND, VIN_12V0, PGOOD, 5V5_OUT
U_Buck_TPSM843321_9V0 = Buck_TPSM843321_9V0.SchDoc: 9V0_Out, 12V0_In, GND

### Ports
5V5_A, 5V5_B, 5V5_C, 9V0_Out, 12V0_In, GND

### Nets
5V5_A: port 5V5_A, sheet Buck_TPSM82913_5V5_A/5V5_OUT
5V5_B: port 5V5_B, sheet Buck_TPSM82913_5V5_B/5V5_OUT
5V5_C: port 5V5_C, sheet Buck_TPSM82913_5V5_C/5V5_OUT
9V0: port 9V0_Out, sheet U_Buck_TPSM843321_9V0/9V0_Out
+12: C14.2 C15.2 C16.2 C17.2 C117.2 C119.2 J1.1 J2.1 J3.1 J4.1 J5.1 J5.2 J10.1 J11.1 ; port 12V0_In, sheet Buck_TPSM82913_5V5_A/VIN_12V0, sheet Buck_TPSM82913_5V5_B/VIN_12V0, sheet Buck_TPSM82913_5V5_C/VIN_12V0, sheet U_Buck_TPSM843321_9V0/12V0_In
GND: C14.1 C15.1 C16.1 C17.1 C117.1 C119.1 J1.2 J2.2 J3.2 J4.2 J6.1 J6.2 J10.2 J11.2 ; port GND, sheet Buck_TPSM82913_5V5_A/GND, sheet Buck_TPSM82913_5V5_B/GND, sheet Buck_TPSM82913_5V5_C/GND, sheet U_Buck_TPSM843321_9V0/GND

### Library data of the parts
C14-C17 C117 C119 = CAP1206: Ceramic Capacitor 1206 Imperial
J1-J4 J10 J11 = Molex 1718560002 2-pin Header with Lock: No Description Available; Mfr_Name: Molex Connector Corporation; RefDes: RefDes; Type: Type
J5 J6 = Amphenol 67997-402HLF 2-pin Header: No Description Available; Mfr_Name: Amphenol ICC; RefDes: RefDes; Type: Type